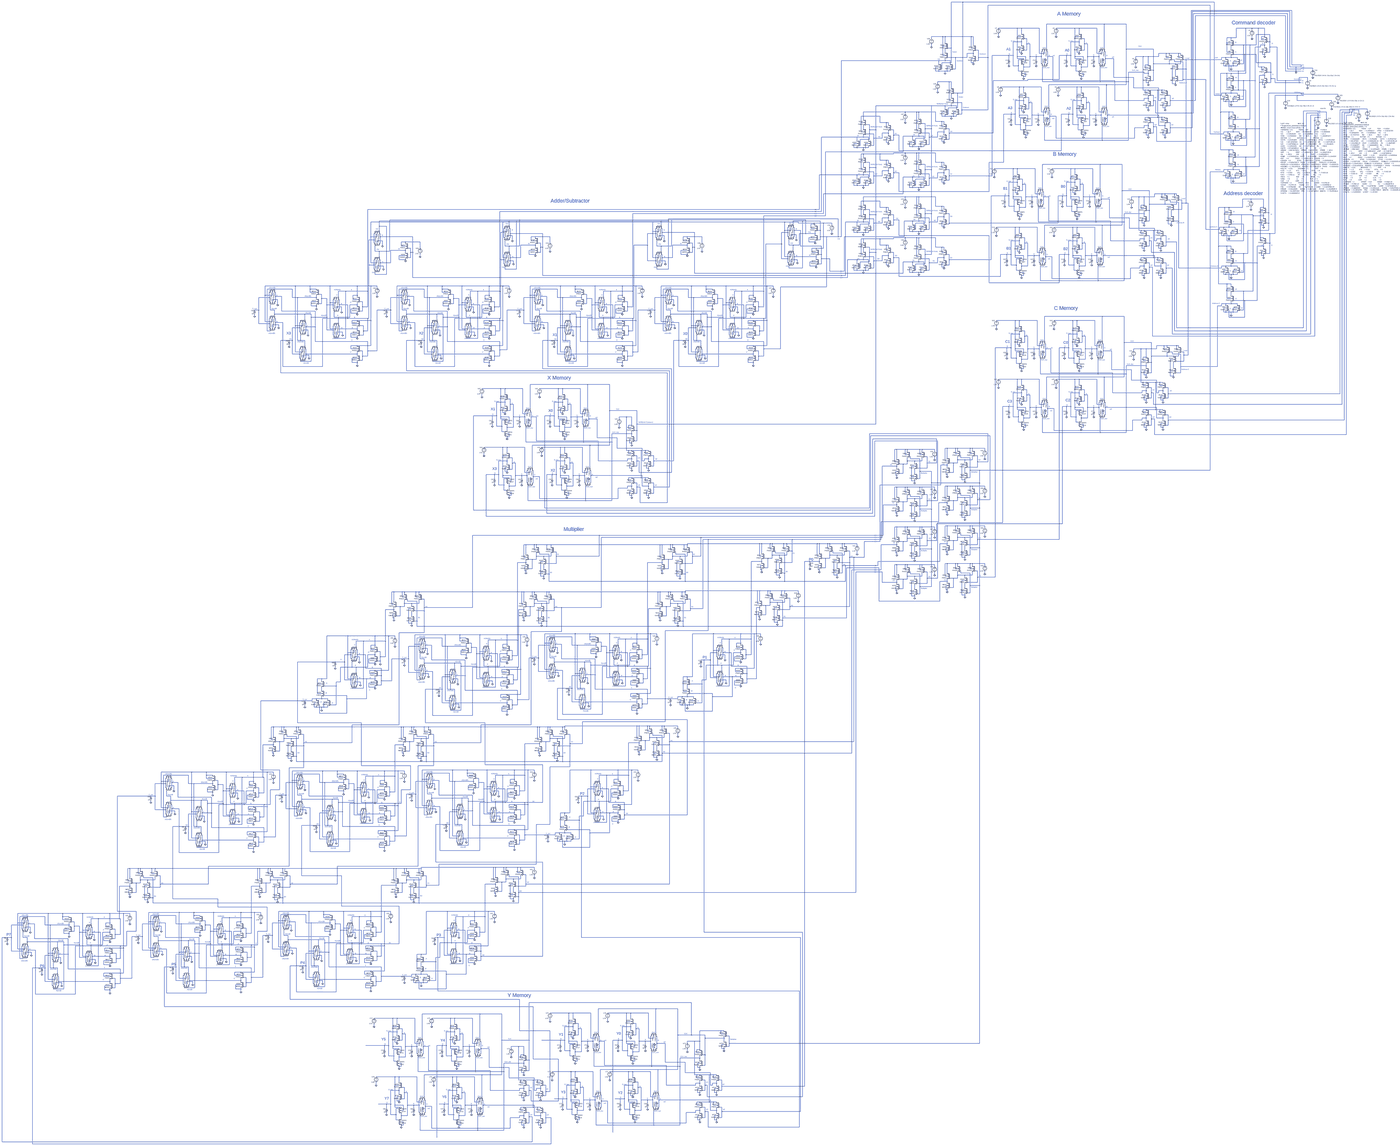
[diagram p0: schematic Ex5_Ex_Multiplier_Working.asc, whole sheet]
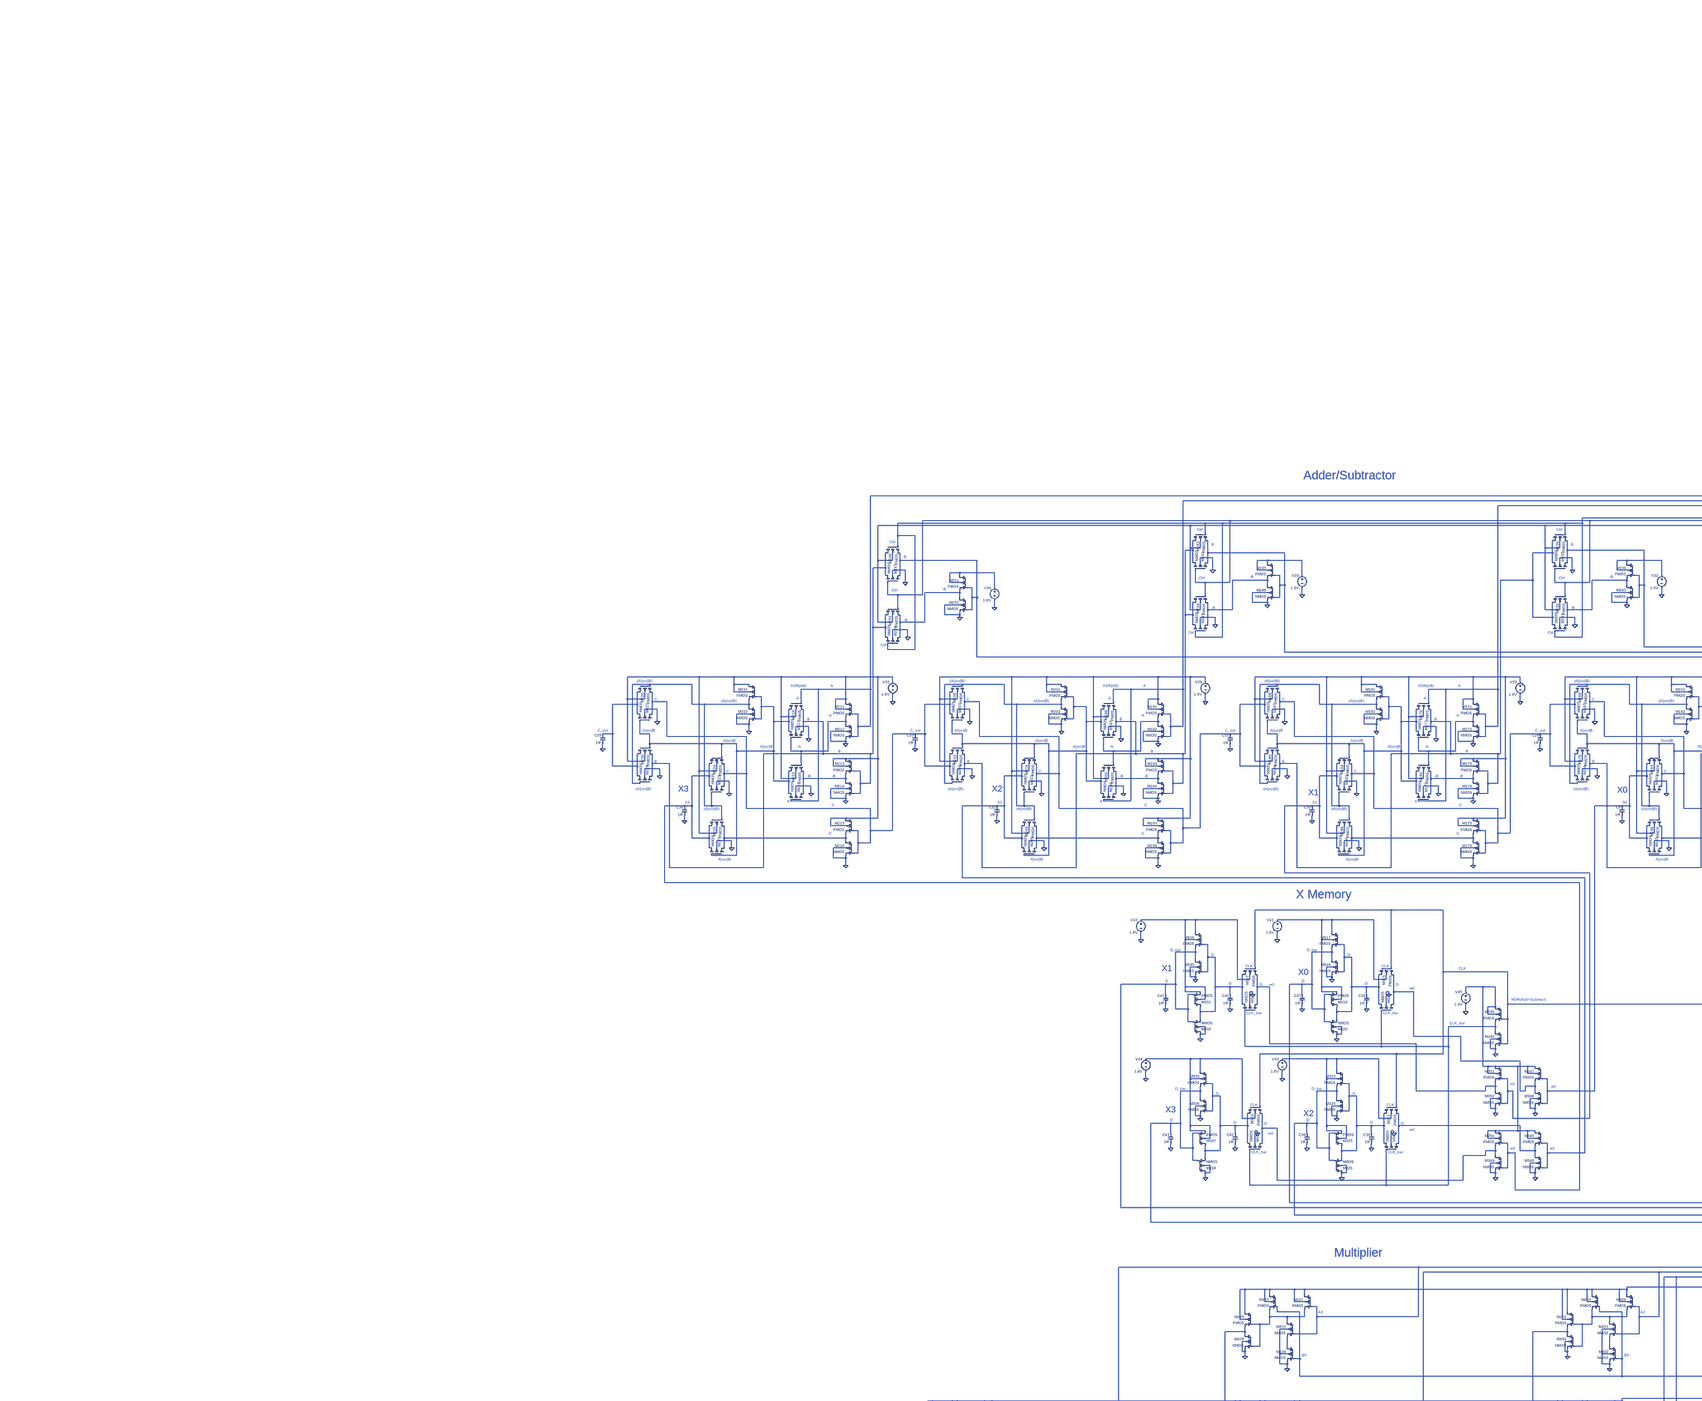
[diagram p1: schematic Ex5_Ex_Multiplier_Working.asc, part, row 1 of 2, column 1 of 2]
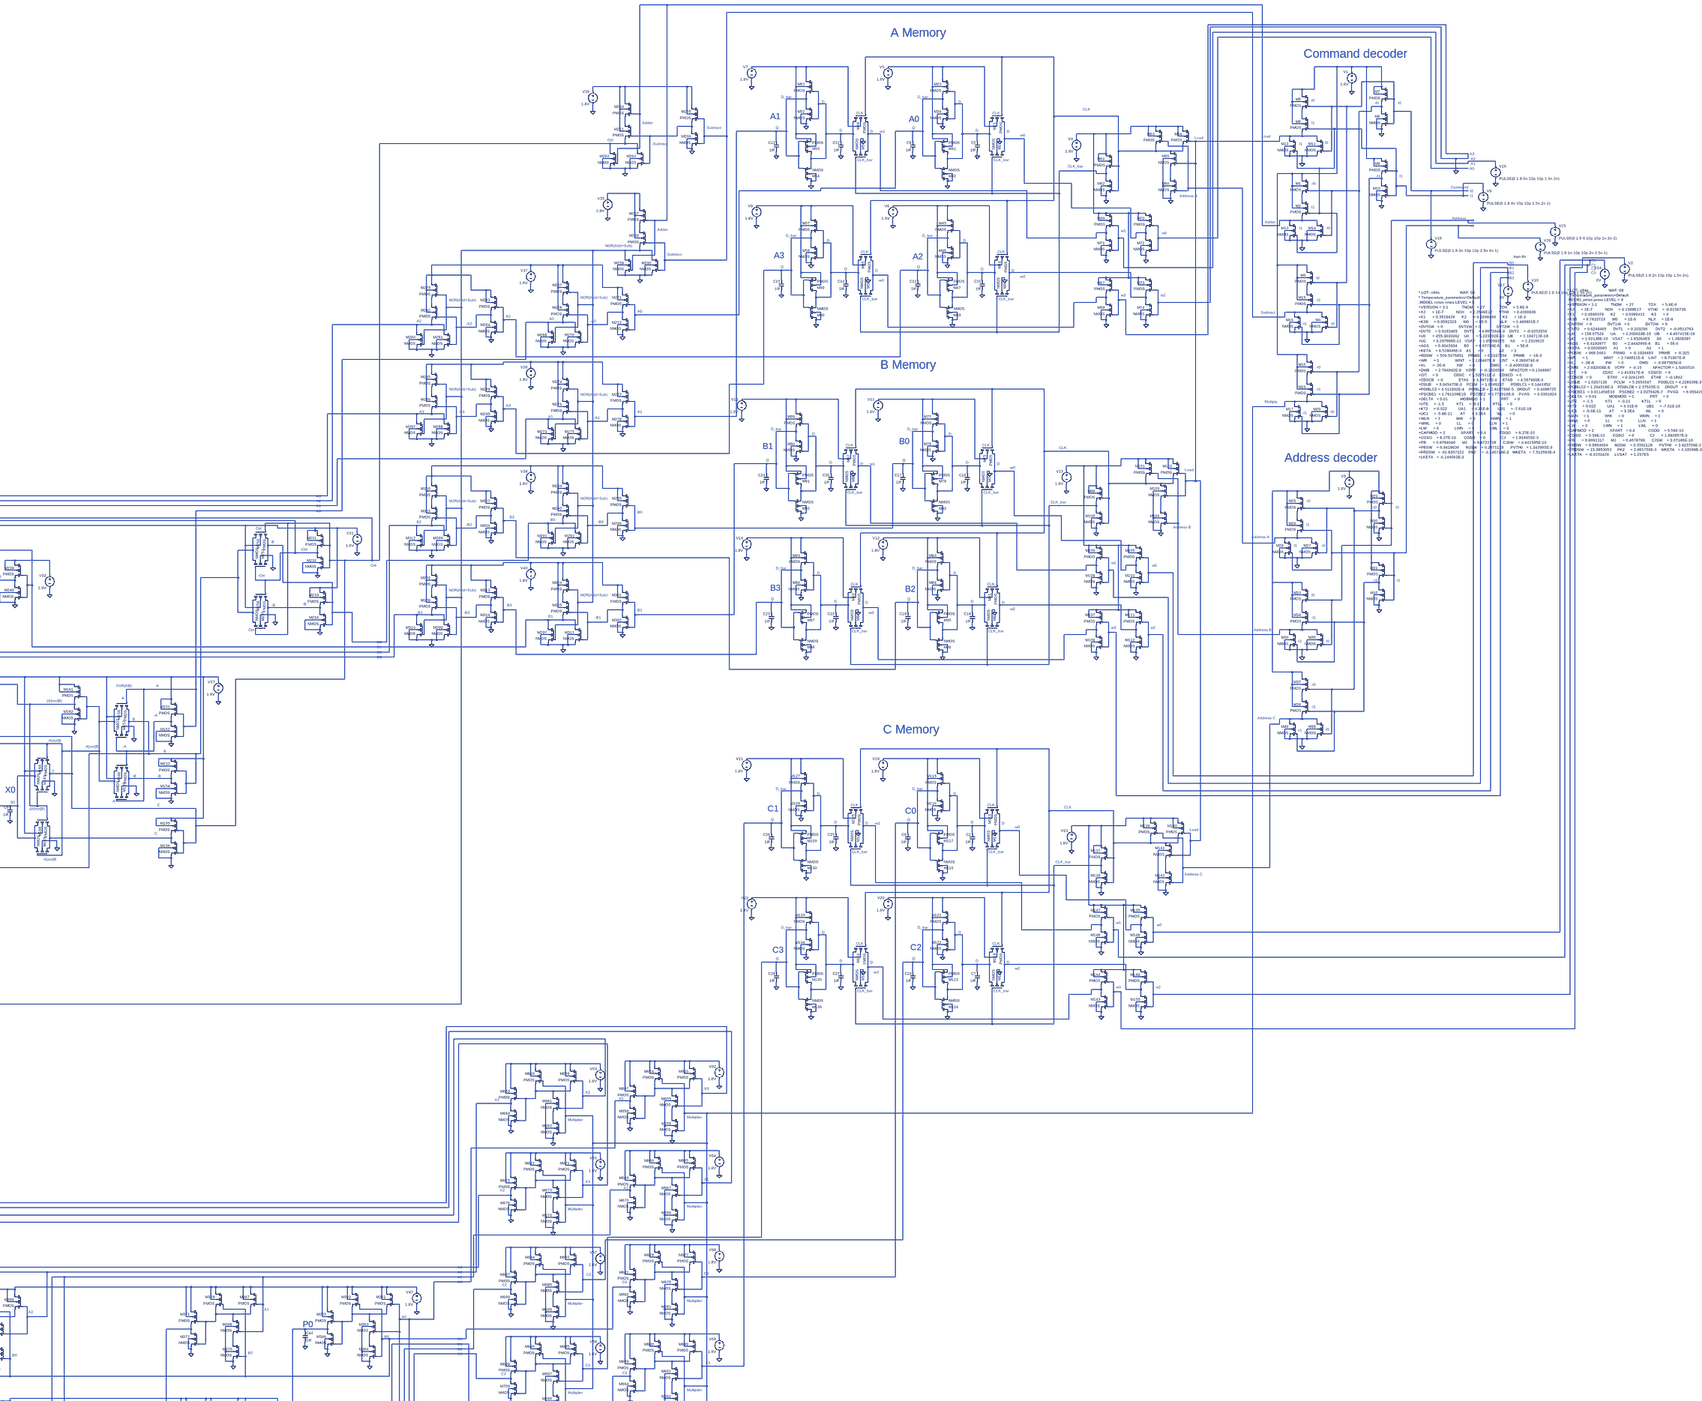
[diagram p2: schematic Ex5_Ex_Multiplier_Working.asc, part, row 1 of 2, column 2 of 2]
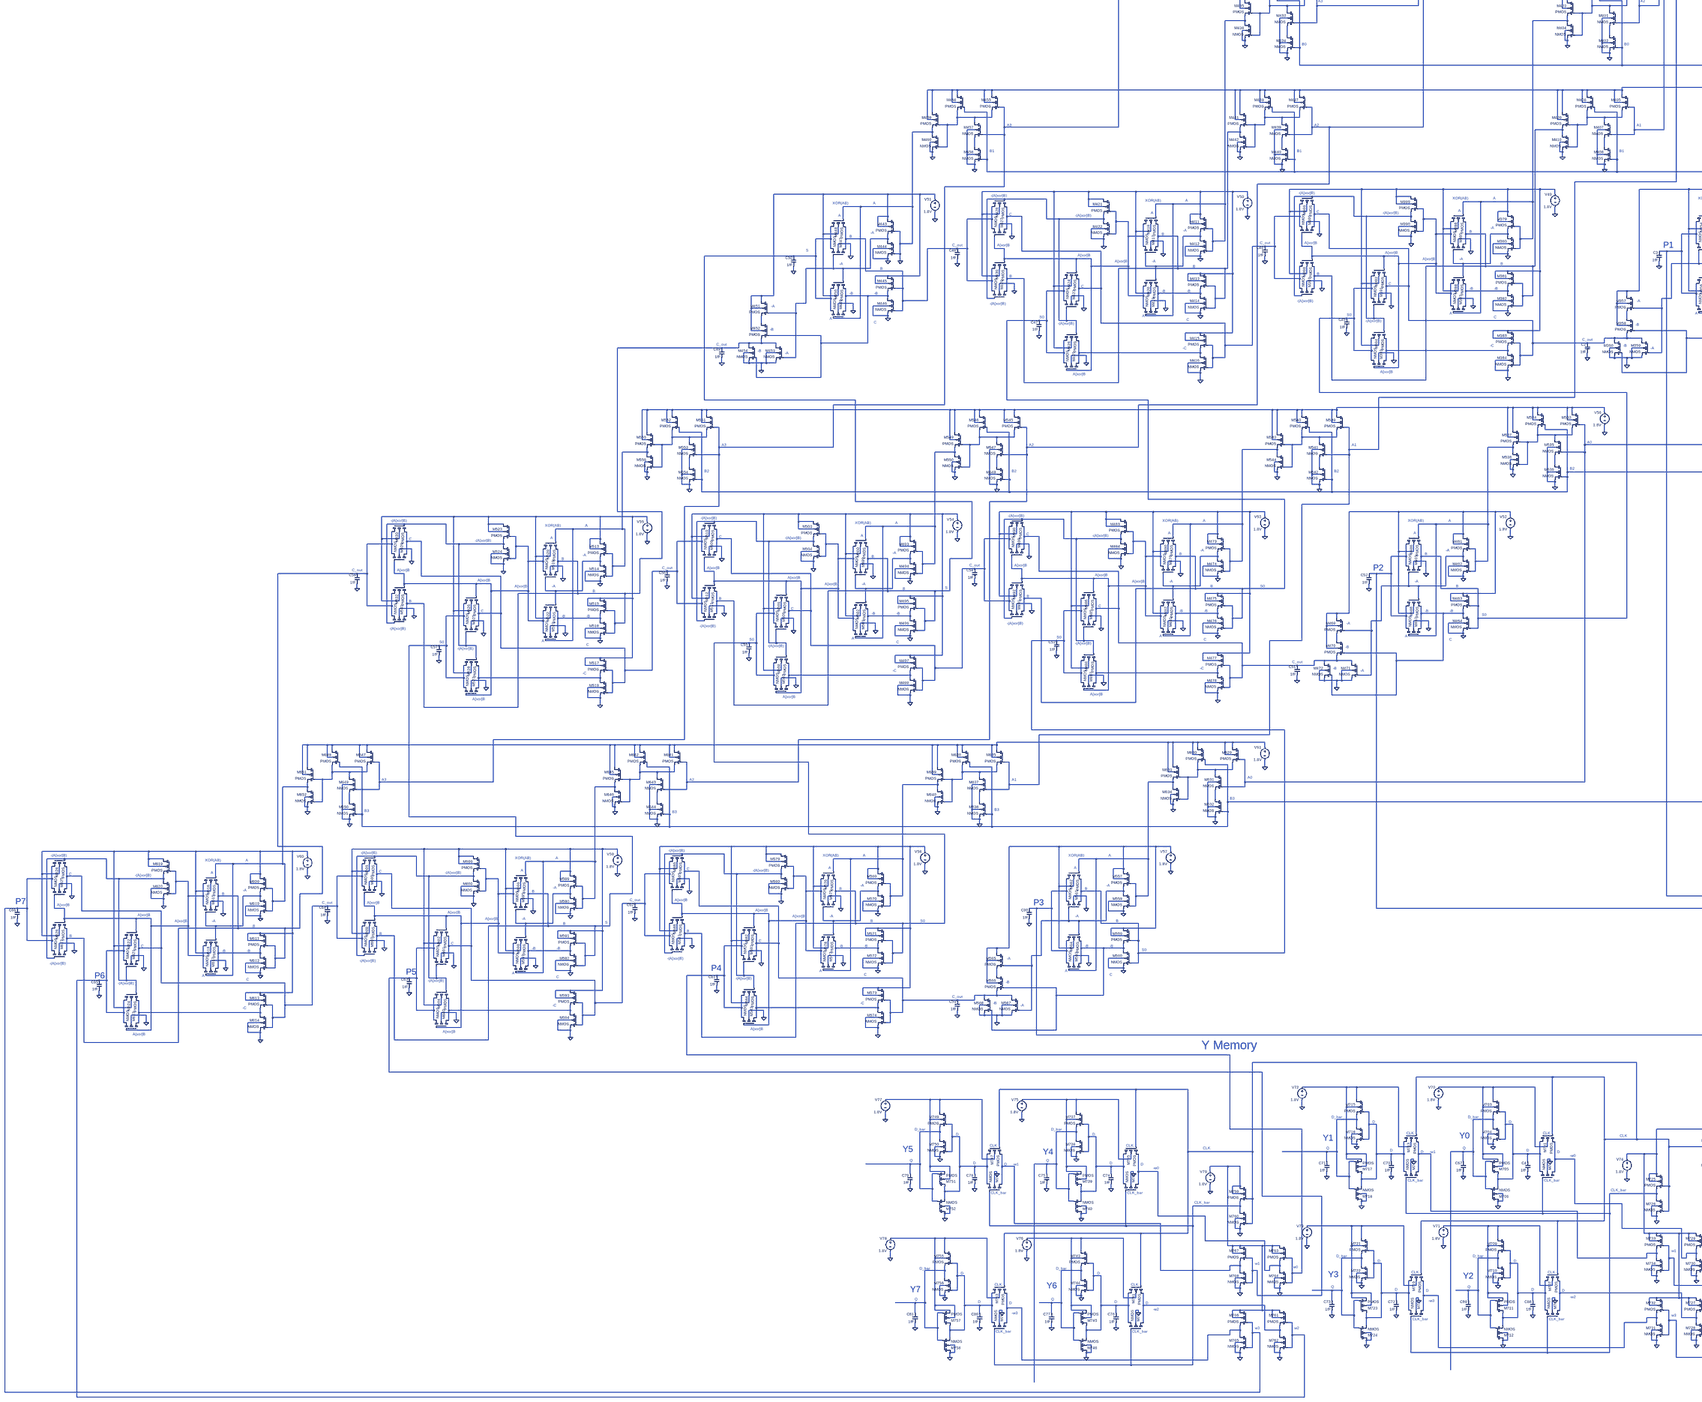
[diagram p3: schematic Ex5_Ex_Multiplier_Working.asc, part, row 2 of 2, column 1 of 2]
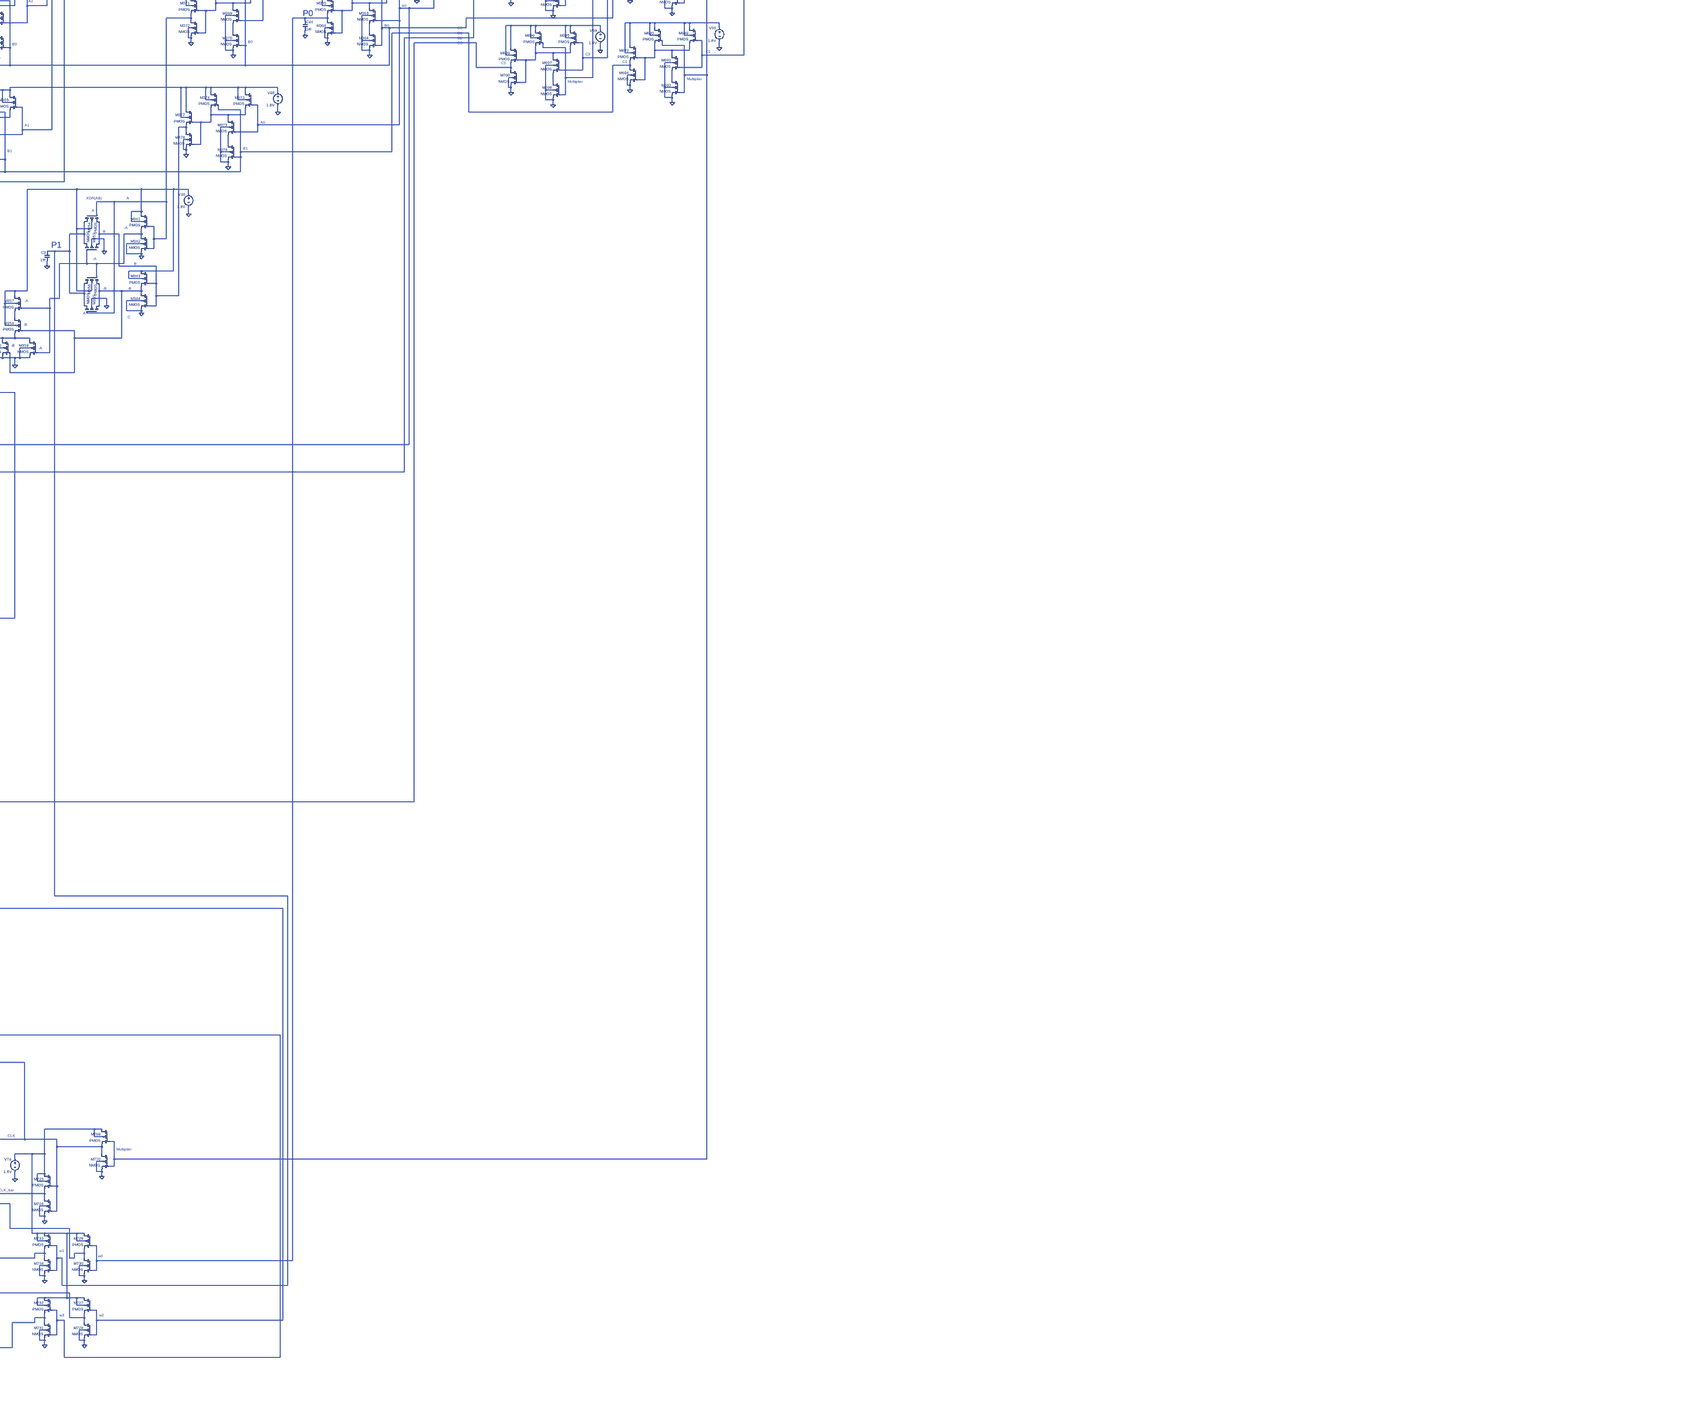
[diagram p4: schematic Ex5_Ex_Multiplier_Working.asc, part, row 2 of 2, column 2 of 2]
* Ex5_Ex_Multiplier_Working.asc
V1 N007 0 1.8V
M5 N007 N008 N015 N007 PMOS l=180n w=4400n
M6 N015 N019 N021 N007 PMOS l=180n w=4400n
M11 N021 N008 0 0 NMOS l=180n w=2200n
M12 N021 N019 0 0 NMOS l=180n w=2200n
M7 N007 N008 N014 N007 PMOS l=180n w=3000n
M8 N014 N008 0 0 NMOS l=180n w=1500n
V3 N074 0 1.8V
M25 N074 N080 N084 N074 PMOS l=180n w=3520n
M26 N084 N033 N023 N074 PMOS l=180n w=3520n
M27 N023 N080 0 0 NMOS l=180n w=1760n
M28 N023 N033 0 0 NMOS l=180n w=1760n
M29 N074 N032 N080 N074 PMOS l=180n w=880n
M30 N080 N032 0 0 NMOS l=180n w=440n
M31 N074 N033 N106 N074 PMOS l=180n w=880n
M32 N106 N033 0 0 NMOS l=180n w=440n
M33 N074 N032 N115 N074 PMOS l=180n w=3520n
M34 N115 N106 N075 N074 PMOS l=180n w=3520n
M35 N075 N032 0 0 NMOS l=180n w=1760n
M36 N075 N106 0 0 NMOS l=180n w=1760n
M37 N074 N080 N128 N074 PMOS l=180n w=3520n
M38 N128 N106 N133 N074 PMOS l=180n w=3520n
M39 N133 N080 0 0 NMOS l=180n w=1760n
M40 N133 N106 0 0 NMOS l=180n w=1760n
M21 N011 N004 N022 N006 PMOS l=180n w=6000n
M22 N022 N025 N011 0 NMOS l=180n w=6000n
M23 N006 N011 N013 N006 PMOS l=180n w=3520n
M24 N013 N011 0 0 NMOS l=180n w=1760n
M41 N011 N013 N006 N006 PMOS l=180n w=880n
M42 0 N013 N011 0 NMOS l=180n w=440n
V5 N006 0 1.8V
C5 N011 0 1fF
C9 N013 0 1fF
M43 N036 N004 N045 N031 PMOS l=180n w=6000n
M44 N045 N025 N036 0 NMOS l=180n w=6000n
M45 N031 N036 N038 N031 PMOS l=180n w=3520n
M46 N038 N036 0 0 NMOS l=180n w=1760n
M47 N036 N038 N031 N031 PMOS l=180n w=880n
M48 0 N038 N036 0 NMOS l=180n w=440n
V6 N031 0 1.8V
C10 N036 0 1fF
C11 N038 0 1fF
M49 N010 N004 N020 N005 PMOS l=180n w=6000n
M50 N020 N025 N010 0 NMOS l=180n w=6000n
M51 N005 N010 N012 N005 PMOS l=180n w=3520n
M52 N012 N010 0 0 NMOS l=180n w=1760n
M53 N010 N012 N005 N005 PMOS l=180n w=880n
M54 0 N012 N010 0 NMOS l=180n w=440n
V7 N005 0 1.8V
C12 N010 0 1fF
C13 N012 0 1fF
M55 N035 N004 N046 N030 PMOS l=180n w=6000n
M56 N046 N025 N035 0 NMOS l=180n w=6000n
M57 N030 N035 N037 N030 PMOS l=180n w=3520n
M58 N037 N035 0 0 NMOS l=180n w=1760n
M59 N035 N037 N030 N030 PMOS l=180n w=880n
M60 0 N037 N035 0 NMOS l=180n w=440n
V8 N030 0 1.8V
C14 N035 0 1fF
C15 N037 0 1fF
V4 N018 0 1.8V
M61 N018 N004 N025 N018 PMOS l=180n w=8800n
M62 N025 N004 0 0 NMOS l=180n w=4400n
M63 N018 N023 N004 N018 PMOS l=180n w=6000n
M64 N018 N021 N004 N018 PMOS l=180n w=6000n
M65 N004 N021 N026 0 NMOS l=180n w=6000n
M66 N026 N023 0 0 NMOS l=180n w=6000n
M75 N067 N056 N073 N060 PMOS l=180n w=6000n
M76 N073 N078 N067 0 NMOS l=180n w=6000n
M77 N060 N067 N069 N060 PMOS l=180n w=3520n
M78 N069 N067 0 0 NMOS l=180n w=1760n
M79 N067 N069 N060 N060 PMOS l=180n w=880n
M80 0 N069 N067 0 NMOS l=180n w=440n
V11 N060 0 1.8V
C16 N067 0 1fF
C17 N069 0 1fF
M81 N100 N056 N111 N090 PMOS l=180n w=6000n
M82 N111 N078 N100 0 NMOS l=180n w=6000n
M83 N090 N100 N079 N090 PMOS l=180n w=3520n
M84 N079 N100 0 0 NMOS l=180n w=1760n
M85 N100 N079 N090 N090 PMOS l=180n w=880n
M86 0 N079 N100 0 NMOS l=180n w=440n
V12 N090 0 1.8V
C18 N100 0 1fF
C19 N079 0 1fF
M87 N066 N056 N072 N059 PMOS l=180n w=6000n
M88 N072 N078 N066 0 NMOS l=180n w=6000n
M89 N059 N066 N068 N059 PMOS l=180n w=3520n
M90 N068 N066 0 0 NMOS l=180n w=1760n
M91 N066 N068 N059 N059 PMOS l=180n w=880n
M92 0 N068 N066 0 NMOS l=180n w=440n
V13 N059 0 1.8V
C20 N066 0 1fF
C21 N068 0 1fF
M93 N099 N056 N113 N089 PMOS l=180n w=6000n
M94 N113 N078 N099 0 NMOS l=180n w=6000n
M95 N089 N099 N102 N089 PMOS l=180n w=3520n
M96 N102 N099 0 0 NMOS l=180n w=1760n
M97 N099 N102 N089 N089 PMOS l=180n w=880n
M98 0 N102 N099 0 NMOS l=180n w=440n
V14 N089 0 1.8V
C22 N099 0 1fF
C23 N102 0 1fF
V15 N070 0 1.8V
M99 N070 N056 N078 N070 PMOS l=180n w=8800n
M100 N078 N056 0 0 NMOS l=180n w=4400n
M101 N070 N075 N056 N070 PMOS l=180n w=6000n
M102 N070 N021 N056 N070 PMOS l=180n w=6000n
M103 N056 N021 N081 0 NMOS l=180n w=6000n
M104 N081 N075 0 0 NMOS l=180n w=6000n
M111 N070 N044 N111 N070 PMOS l=180n w=4000n
M112 N111 N044 0 0 NMOS l=180n w=2000n
V17 N044 0 0V
V18 N008 0 PULSE(0 1.8 3n 10p 10p 2.5n 4n 1)
M113 N150 N138 N155 N140 PMOS l=180n w=6000n
M114 N155 N160 N150 0 NMOS l=180n w=6000n
M115 N140 N150 N152 N140 PMOS l=180n w=3520n
M116 N152 N150 0 0 NMOS l=180n w=1760n
M117 N150 N152 N140 N140 PMOS l=180n w=880n
M118 0 N152 N150 0 NMOS l=180n w=440n
V19 N140 0 1.8V
C1 N150 0 1fF
C6 N152 0 1fF
M119 N167 N138 N174 N163 PMOS l=180n w=6000n
M120 N174 N160 N167 0 NMOS l=180n w=6000n
M121 N163 N167 N169 N163 PMOS l=180n w=3520n
M122 N169 N167 0 0 NMOS l=180n w=1760n
M123 N167 N169 N163 N163 PMOS l=180n w=880n
M124 0 N169 N167 0 NMOS l=180n w=440n
V20 N163 0 1.8V
C7 N167 0 1fF
C24 N169 0 1fF
M125 N149 N138 N154 N139 PMOS l=180n w=6000n
M126 N154 N160 N149 0 NMOS l=180n w=6000n
M127 N139 N149 N151 N139 PMOS l=180n w=3520n
M128 N151 N149 0 0 NMOS l=180n w=1760n
M129 N149 N151 N139 N139 PMOS l=180n w=880n
M130 0 N151 N149 0 NMOS l=180n w=440n
V21 N139 0 1.8V
C25 N149 0 1fF
C26 N151 0 1fF
M131 N166 N138 N175 N162 PMOS l=180n w=6000n
M132 N175 N160 N166 0 NMOS l=180n w=6000n
M133 N162 N166 N168 N162 PMOS l=180n w=3520n
M134 N168 N166 0 0 NMOS l=180n w=1760n
M135 N166 N168 N162 N162 PMOS l=180n w=880n
M136 0 N168 N166 0 NMOS l=180n w=440n
V22 N162 0 1.8V
C27 N166 0 1fF
C28 N168 0 1fF
V23 N153 0 1.8V
M137 N153 N138 N160 N153 PMOS l=180n w=8800n
M138 N160 N138 0 0 NMOS l=180n w=4400n
M139 N153 N133 N138 N153 PMOS l=180n w=6000n
M140 N153 N021 N138 N153 PMOS l=180n w=6000n
M141 N138 N021 N161 0 NMOS l=180n w=6000n
M142 N161 N133 0 0 NMOS l=180n w=6000n
M149 N153 N040 N174 N153 PMOS l=180n w=4000n
M150 N174 N040 0 0 NMOS l=180n w=2000n
V24 N041 0 0V
M145 N153 N041 N155 N153 PMOS l=180n w=4000n
M146 N155 N041 0 0 NMOS l=180n w=2000n
M143 N175 N041 0 0 NMOS l=180n w=2000n
M144 N153 N041 N175 N153 PMOS l=180n w=4000n
M147 N153 N041 N154 N153 PMOS l=180n w=4000n
M148 N154 N041 0 0 NMOS l=180n w=2000n
M105 N070 N042 N073 N070 PMOS l=180n w=4000n
M106 N070 N044 N072 N070 PMOS l=180n w=4000n
M107 N070 N044 N113 N070 PMOS l=180n w=4000n
M108 N113 N044 0 0 NMOS l=180n w=2000n
M109 N072 N044 0 0 NMOS l=180n w=2000n
M110 N073 N042 0 0 NMOS l=180n w=2000n
M73 N018 0 N045 N018 PMOS l=180n w=4000n
M74 N045 0 0 0 NMOS l=180n w=2000n
M67 N018 0 N046 N018 PMOS l=180n w=4000n
M68 N046 0 0 0 NMOS l=180n w=2000n
M69 N018 N003 N020 N018 PMOS l=180n w=4000n
M70 N018 0 N022 N018 PMOS l=180n w=4000n
M71 N020 N003 0 0 NMOS l=180n w=2000n
M72 N022 0 0 0 NMOS l=180n w=2000n
V27 N119 0 1.8V
M151 N119 N052 N137 N119 PMOS l=180n w=880n
M152 N137 N052 0 0 NMOS l=180n w=440n
M153 N119 N093 N148 N119 PMOS l=180n w=880n
M154 N148 N093 0 0 NMOS l=180n w=440n
M155 N119 N024 N159 N119 PMOS l=180n w=880n
M156 N159 N024 0 0 NMOS l=180n w=440n
M157 N093 N137 N127 0 NMOS l=180n w=440n
M158 N127 N052 N093 N119 PMOS l=180n w=440n
M159 N148 N052 N127 0 NMOS l=180n w=440n
M160 N127 N137 N148 N119 PMOS l=180n w=440n
M161 N119 N127 N123 N119 PMOS l=180n w=880n
M162 N123 N127 0 0 NMOS l=180n w=440n
M163 N024 N123 N144 0 NMOS l=180n w=440n
M164 N144 N127 N024 N119 PMOS l=180n w=440n
M165 N159 N127 N144 0 NMOS l=180n w=440n
M166 N144 N123 N159 N119 PMOS l=180n w=440n
C8 N144 0 1fF
M167 N024 N127 N131 0 NMOS l=180n w=440n
M168 N131 N123 N024 N119 PMOS l=180n w=440n
M169 N093 N123 N131 0 NMOS l=180n w=440n
M170 N131 N127 N093 N119 PMOS l=180n w=440n
C29 N131 0 1fF
V28 N118 0 1.8V
M171 N118 N065 N136 N118 PMOS l=180n w=880n
M172 N136 N065 0 0 NMOS l=180n w=440n
M173 N118 N094 N147 N118 PMOS l=180n w=880n
M174 N147 N094 0 0 NMOS l=180n w=440n
M175 N118 N131 N158 N118 PMOS l=180n w=880n
M176 N158 N131 0 0 NMOS l=180n w=440n
M177 N094 N136 N126 0 NMOS l=180n w=440n
M178 N126 N065 N094 N118 PMOS l=180n w=440n
M179 N147 N065 N126 0 NMOS l=180n w=440n
M180 N126 N136 N147 N118 PMOS l=180n w=440n
M181 N118 N126 N122 N118 PMOS l=180n w=880n
M182 N122 N126 0 0 NMOS l=180n w=440n
M183 N131 N122 N143 0 NMOS l=180n w=440n
M184 N143 N126 N131 N118 PMOS l=180n w=440n
M185 N158 N126 N143 0 NMOS l=180n w=440n
M186 N143 N122 N158 N118 PMOS l=180n w=440n
C30 N143 0 1fF
M187 N131 N126 N130 0 NMOS l=180n w=440n
M188 N130 N122 N131 N118 PMOS l=180n w=440n
M189 N094 N122 N130 0 NMOS l=180n w=440n
M190 N130 N126 N094 N118 PMOS l=180n w=440n
C31 N130 0 1fF
V29 N117 0 1.8V
M191 N117 N053 N135 N117 PMOS l=180n w=880n
M192 N135 N053 0 0 NMOS l=180n w=440n
M193 N117 N091 N146 N117 PMOS l=180n w=880n
M194 N146 N091 0 0 NMOS l=180n w=440n
M195 N117 N130 N157 N117 PMOS l=180n w=880n
M196 N157 N130 0 0 NMOS l=180n w=440n
M197 N091 N135 N125 0 NMOS l=180n w=440n
M198 N125 N053 N091 N117 PMOS l=180n w=440n
M199 N146 N053 N125 0 NMOS l=180n w=440n
M200 N125 N135 N146 N117 PMOS l=180n w=440n
M201 N117 N125 N121 N117 PMOS l=180n w=880n
M202 N121 N125 0 0 NMOS l=180n w=440n
M203 N130 N121 N142 0 NMOS l=180n w=440n
M204 N142 N125 N130 N117 PMOS l=180n w=440n
M205 N157 N125 N142 0 NMOS l=180n w=440n
M206 N142 N121 N157 N117 PMOS l=180n w=440n
C32 N142 0 1fF
M207 N130 N125 N129 0 NMOS l=180n w=440n
M208 N129 N121 N130 N117 PMOS l=180n w=440n
M209 N091 N121 N129 0 NMOS l=180n w=440n
M210 N129 N125 N091 N117 PMOS l=180n w=440n
C33 N129 0 1fF
V30 N116 0 1.8V
M211 N116 N064 N134 N116 PMOS l=180n w=880n
M212 N134 N064 0 0 NMOS l=180n w=440n
M213 N116 N101 N145 N116 PMOS l=180n w=880n
M214 N145 N101 0 0 NMOS l=180n w=440n
M215 N116 N129 N156 N116 PMOS l=180n w=880n
M216 N156 N129 0 0 NMOS l=180n w=440n
M217 N101 N134 N124 0 NMOS l=180n w=440n
M218 N124 N064 N101 N116 PMOS l=180n w=440n
M219 N145 N064 N124 0 NMOS l=180n w=440n
M220 N124 N134 N145 N116 PMOS l=180n w=440n
M221 N116 N124 N120 N116 PMOS l=180n w=880n
M222 N120 N124 0 0 NMOS l=180n w=440n
M223 N129 N120 N141 0 NMOS l=180n w=440n
M224 N141 N124 N129 N116 PMOS l=180n w=440n
M225 N156 N124 N141 0 NMOS l=180n w=440n
M226 N141 N120 N156 N116 PMOS l=180n w=440n
C34 N141 0 1fF
M227 N129 N124 N132 0 NMOS l=180n w=440n
M228 N132 N120 N129 N116 PMOS l=180n w=440n
M229 N101 N120 N132 0 NMOS l=180n w=440n
M230 N132 N124 N101 N116 PMOS l=180n w=440n
C35 N132 0 1fF
M231 N087 N024 N085 N087 PMOS l=180n w=880n
M232 N085 N024 0 0 NMOS l=180n w=440n
M233 N087 N086 N112 N087 PMOS l=180n w=880n
M234 N112 N086 0 0 NMOS l=180n w=440n
V31 N087 0 1.8V
M235 N092 N085 N094 0 NMOS l=180n w=440n
M236 N094 N024 N092 N087 PMOS l=180n w=440n
M237 N105 N024 N094 0 NMOS l=180n w=440n
M238 N094 N085 N105 N087 PMOS l=180n w=440n
M239 N097 N092 N105 N097 PMOS l=180n w=880n
M240 N105 N092 0 0 NMOS l=180n w=440n
V32 N097 0 1.8V
M241 N088 N085 N091 0 NMOS l=180n w=440n
M242 N091 N024 N088 N087 PMOS l=180n w=440n
M243 N104 N024 N091 0 NMOS l=180n w=440n
M244 N091 N085 N104 N087 PMOS l=180n w=440n
M245 N096 N088 N104 N096 PMOS l=180n w=880n
M246 N104 N088 0 0 NMOS l=180n w=440n
V33 N096 0 1.8V
M247 N095 N085 N101 0 NMOS l=180n w=440n
M248 N101 N024 N095 N087 PMOS l=180n w=440n
M249 N107 N024 N101 0 NMOS l=180n w=440n
M250 N101 N085 N107 N087 PMOS l=180n w=440n
M251 N103 N095 N107 N103 PMOS l=180n w=880n
M252 N107 N095 0 0 NMOS l=180n w=440n
V34 N103 0 1.8V
M253 N086 N085 N093 0 NMOS l=180n w=440n
M254 N093 N024 N086 N087 PMOS l=180n w=440n
M255 N112 N024 N093 0 NMOS l=180n w=440n
M256 N093 N085 N112 N087 PMOS l=180n w=440n
V35 N028 0 1.8V
M264 N009 N001 N016 N009 PMOS l=180n w=6000n
V36 N009 0 1.8V
M265 N009 N002 N017 N009 PMOS l=180n w=3000n
M266 N017 N002 0 0 NMOS l=180n w=1500n
V37 N043 0 1.8V
M271 N043 N013 N050 N043 PMOS l=180n w=880n
M272 N050 N013 0 0 NMOS l=180n w=440n
V38 N054 0 1.8V
M277 N054 N012 N063 N054 PMOS l=180n w=880n
M278 N063 N012 0 0 NMOS l=180n w=440n
M283 N043 N038 N051 N043 PMOS l=180n w=880n
M284 N051 N038 0 0 NMOS l=180n w=440n
M289 N054 N037 N062 N054 PMOS l=180n w=880n
M290 N062 N037 0 0 NMOS l=180n w=440n
M291 N086 N039 0 0 NMOS l=180n w=750n
M294 N071 N039 N076 N071 PMOS l=180n w=3000n
V39 N071 0 1.8V
M295 N071 N069 N082 N071 PMOS l=180n w=880n
M296 N082 N069 0 0 NMOS l=180n w=440n
V40 N098 0 1.8V
M301 N098 N068 N114 N098 PMOS l=180n w=880n
M302 N114 N068 0 0 NMOS l=180n w=440n
M307 N071 N079 N083 N071 PMOS l=180n w=880n
M308 N083 N079 0 0 NMOS l=180n w=440n
M313 N098 N102 N110 N098 PMOS l=180n w=880n
M314 N110 N102 0 0 NMOS l=180n w=440n
M315 N171 N039 N178 N165 PMOS l=180n w=6000n
M316 N178 N179 N171 0 NMOS l=180n w=6000n
M317 N165 N171 N173 N165 PMOS l=180n w=3520n
M318 N173 N171 0 0 NMOS l=180n w=1760n
M319 N171 N173 N165 N165 PMOS l=180n w=880n
M320 0 N173 N171 0 NMOS l=180n w=440n
V41 N165 0 1.8V
C36 N171 0 1fF
C37 N173 0 1fF
M321 N187 N039 N194 N183 PMOS l=180n w=6000n
M322 N194 N179 N187 0 NMOS l=180n w=6000n
M323 N183 N187 N180 N183 PMOS l=180n w=3520n
M324 N180 N187 0 0 NMOS l=180n w=1760n
M325 N187 N180 N183 N183 PMOS l=180n w=880n
M326 0 N180 N187 0 NMOS l=180n w=440n
V42 N183 0 1.8V
C38 N187 0 1fF
C39 N180 0 1fF
M327 N170 N039 N176 N164 PMOS l=180n w=6000n
M328 N176 N179 N170 0 NMOS l=180n w=6000n
M329 N164 N170 N172 N164 PMOS l=180n w=3520n
M330 N172 N170 0 0 NMOS l=180n w=1760n
M331 N170 N172 N164 N164 PMOS l=180n w=880n
M332 0 N172 N170 0 NMOS l=180n w=440n
V43 N164 0 1.8V
C40 N170 0 1fF
C41 N172 0 1fF
M333 N186 N039 N195 N182 PMOS l=180n w=6000n
M334 N195 N179 N186 0 NMOS l=180n w=6000n
M335 N182 N186 N181 N182 PMOS l=180n w=3520n
M336 N181 N186 0 0 NMOS l=180n w=1760n
M337 N186 N181 N182 N182 PMOS l=180n w=880n
M338 0 N181 N186 0 NMOS l=180n w=440n
V44 N182 0 1.8V
C42 N186 0 1fF
C43 N181 0 1fF
V45 N177 0 1.8V
M339 N177 N039 N179 N177 PMOS l=180n w=8800n
M340 N179 N039 0 0 NMOS l=180n w=4400n
M345 N177 N142 N194 N177 PMOS l=180n w=4000n
M346 N194 N142 0 0 NMOS l=180n w=2000n
M347 N177 N144 N178 N177 PMOS l=180n w=4000n
M348 N178 N144 0 0 NMOS l=180n w=2000n
M349 N195 N141 0 0 NMOS l=180n w=2000n
M350 N177 N141 N195 N177 PMOS l=180n w=4000n
M351 N177 N143 N176 N177 PMOS l=180n w=4000n
M352 N176 N143 0 0 NMOS l=180n w=2000n
M1 N007 N014 N029 N007 PMOS l=180n w=4400n
M2 N029 N019 N001 N007 PMOS l=180n w=4400n
M13 N001 N019 0 0 NMOS l=180n w=2200n
M14 N001 N014 0 0 NMOS l=180n w=2200n
M9 N007 N019 N027 N007 PMOS l=180n w=3000n
M10 N027 N019 0 0 NMOS l=180n w=1500n
M261 N016 N017 N024 N009 PMOS l=180n w=6000n
M262 N024 N017 0 0 NMOS l=180n w=1500n
M263 N024 N001 0 0 NMOS l=180n w=1500n
M257 N028 N001 N034 N028 PMOS l=180n w=6000n
M258 N034 N002 N039 N028 PMOS l=180n w=6000n
M259 N039 N001 0 0 NMOS l=180n w=2500n
V2 N040 0 PULSE(0 1.8 2n 10p 10p 1,5n 2n)
V10 N042 0 PULSE(0 1.8 1n 10p 10p 1.5n 2n)
V16 N003 0 PULSE(0 1.8 0n 10p 10p 1.5n 2n)
V25 N032 0 PULSE(0 1.8 0 10p 10p 1n 2n 2)
V26 N033 0 PULSE(0 1.8 1n 10p 10p 2n 2.5n 1)
M260 N039 N002 0 0 NMOS l=180n w=2500n
M292 N076 N082 N086 N071 PMOS l=180n w=3000n
M293 N086 N082 0 0 NMOS l=180n w=750n
M273 N065 N039 0 0 NMOS l=180n w=750n
M274 N054 N039 N058 N054 PMOS l=180n w=3000n
M275 N065 N063 0 0 NMOS l=180n w=750n
M276 N058 N063 N065 N054 PMOS l=180n w=3000n
M267 N043 N039 N048 N043 PMOS l=180n w=3000n
M268 N048 N050 N052 N043 PMOS l=180n w=3000n
M269 N052 N039 0 0 NMOS l=180n w=750n
M270 N052 N050 0 0 NMOS l=180n w=750n
M279 N043 N039 N049 N043 PMOS l=180n w=3000n
M280 N053 N039 0 0 NMOS l=180n w=750n
M281 N053 N051 0 0 NMOS l=180n w=750n
M282 N049 N051 N053 N043 PMOS l=180n w=3000n
M285 N054 N039 N057 N054 PMOS l=180n w=3000n
M286 N057 N062 N064 N054 PMOS l=180n w=3000n
M287 N064 N039 0 0 NMOS l=180n w=750n
M288 N064 N062 0 0 NMOS l=180n w=750n
M297 N092 N039 0 0 NMOS l=180n w=750n
M298 N095 N110 0 0 NMOS l=180n w=750n
M299 N088 N083 0 0 NMOS l=180n w=750n
M300 N071 N039 N077 N071 PMOS l=180n w=3000n
M303 N077 N083 N088 N071 PMOS l=180n w=3000n
M304 N098 N039 N109 N098 PMOS l=180n w=3000n
M305 N109 N114 N092 N098 PMOS l=180n w=3000n
M306 N098 N039 N108 N098 PMOS l=180n w=3000n
M309 N108 N110 N095 N098 PMOS l=180n w=3000n
M310 N095 N039 0 0 NMOS l=180n w=750n
M311 N092 N114 0 0 NMOS l=180n w=750n
M312 N088 N039 0 0 NMOS l=180n w=750n
V9 N019 0 PULSE(0 1.8 4n 10p 10p 1.5n 2n 1)
V46 N246 0 1.8V
M341 N246 N217 N258 N246 PMOS l=180n w=880n
M342 N258 N217 0 0 NMOS l=180n w=440n
M343 N246 N238 N265 N246 PMOS l=180n w=880n
M344 N265 N238 0 0 NMOS l=180n w=440n
M353 N238 N258 N257 0 NMOS l=180n w=440n
M354 N257 N217 N238 N246 PMOS l=180n w=440n
M355 N265 N217 N257 0 NMOS l=180n w=440n
M356 N257 N258 N265 N246 PMOS l=180n w=440n
C2 N253 0 1fF
C3 N257 0 1fF
M357 N246 N258 N268 N246 PMOS l=180n w=1760n
M358 N268 N265 N253 N246 PMOS l=180n w=1760n
M359 N253 N258 0 0 NMOS l=180n w=440n
M360 N253 N265 0 0 NMOS l=180n w=440n
M361 N208 N190 N214 N208 PMOS l=180n w=880n
M362 N208 N209 N214 N208 PMOS l=180n w=880n
M363 N214 N190 N224 0 NMOS l=180n w=880n
M364 N224 N209 0 0 NMOS l=180n w=880n
M365 N208 N214 N218 N208 PMOS l=180n w=880n
M366 N218 N214 0 0 NMOS l=180n w=440n
V47 N208 0 1.8V
C44 N218 0 1fF
M367 N208 N200 N213 N208 PMOS l=180n w=880n
M368 N208 N209 N213 N208 PMOS l=180n w=880n
M369 N213 N200 N223 0 NMOS l=180n w=880n
M370 N223 N209 0 0 NMOS l=180n w=880n
M371 N208 N213 N217 N208 PMOS l=180n w=880n
M372 N217 N213 0 0 NMOS l=180n w=440n
M373 N233 N190 N234 N233 PMOS l=180n w=880n
M374 N233 N225 N234 N233 PMOS l=180n w=880n
M375 N234 N190 N241 0 NMOS l=180n w=880n
M376 N241 N225 0 0 NMOS l=180n w=880n
M377 N233 N234 N238 N233 PMOS l=180n w=880n
M378 N238 N234 0 0 NMOS l=180n w=440n
V48 N233 0 1.8V
V49 N245 0 1.8V
M379 N245 N220 N256 N245 PMOS l=180n w=880n
M380 N256 N220 0 0 NMOS l=180n w=440n
M381 N245 N239 N264 N245 PMOS l=180n w=880n
M382 N264 N239 0 0 NMOS l=180n w=440n
M383 N245 N253 N271 N245 PMOS l=180n w=880n
M384 N271 N253 0 0 NMOS l=180n w=440n
M385 N239 N256 N251 0 NMOS l=180n w=440n
M386 N251 N220 N239 N245 PMOS l=180n w=440n
M387 N264 N220 N251 0 NMOS l=180n w=440n
M388 N251 N256 N264 N245 PMOS l=180n w=440n
M389 N245 N251 N249 N245 PMOS l=180n w=880n
M390 N249 N251 0 0 NMOS l=180n w=440n
M391 N253 N249 N262 0 NMOS l=180n w=440n
M392 N262 N251 N253 N245 PMOS l=180n w=440n
M393 N271 N251 N262 0 NMOS l=180n w=440n
M394 N262 N249 N271 N245 PMOS l=180n w=440n
C45 N262 0 1fF
M395 N253 N251 N254 0 NMOS l=180n w=440n
M396 N254 N249 N253 N245 PMOS l=180n w=440n
M397 N239 N249 N254 0 NMOS l=180n w=440n
M398 N254 N251 N239 N245 PMOS l=180n w=440n
C46 N254 0 1fF
M399 N208 N191 N216 N208 PMOS l=180n w=880n
M400 N208 N209 N216 N208 PMOS l=180n w=880n
M401 N216 N191 N227 0 NMOS l=180n w=880n
M402 N227 N209 0 0 NMOS l=180n w=880n
M403 N208 N216 N220 N208 PMOS l=180n w=880n
M404 N220 N216 0 0 NMOS l=180n w=440n
M405 N233 N200 N237 N233 PMOS l=180n w=880n
M406 N233 N225 N237 N233 PMOS l=180n w=880n
M407 N237 N200 N244 0 NMOS l=180n w=880n
M408 N244 N225 0 0 NMOS l=180n w=880n
M409 N233 N237 N239 N233 PMOS l=180n w=880n
M410 N239 N237 0 0 NMOS l=180n w=440n
V50 N247 0 1.8V
M411 N247 N219 N259 N247 PMOS l=180n w=880n
M412 N259 N219 0 0 NMOS l=180n w=440n
M413 N247 N240 N266 N247 PMOS l=180n w=880n
M414 N266 N240 0 0 NMOS l=180n w=440n
M415 N247 N254 N272 N247 PMOS l=180n w=880n
M416 N272 N254 0 0 NMOS l=180n w=440n
M417 N240 N259 N252 0 NMOS l=180n w=440n
M418 N252 N219 N240 N247 PMOS l=180n w=440n
M419 N266 N219 N252 0 NMOS l=180n w=440n
M420 N252 N259 N266 N247 PMOS l=180n w=440n
M421 N247 N252 N250 N247 PMOS l=180n w=880n
M422 N250 N252 0 0 NMOS l=180n w=440n
M423 N254 N250 N263 0 NMOS l=180n w=440n
M424 N263 N252 N254 N247 PMOS l=180n w=440n
M425 N272 N252 N263 0 NMOS l=180n w=440n
M426 N263 N250 N272 N247 PMOS l=180n w=440n
C47 N263 0 1fF
M427 N254 N252 N255 0 NMOS l=180n w=440n
M428 N255 N250 N254 N247 PMOS l=180n w=440n
M429 N240 N250 N255 0 NMOS l=180n w=440n
M430 N255 N252 N240 N247 PMOS l=180n w=440n
C48 N255 0 1fF
M431 N208 N201 N215 N208 PMOS l=180n w=880n
M432 N208 N209 N215 N208 PMOS l=180n w=880n
M433 N215 N201 N226 0 NMOS l=180n w=880n
M434 N226 N209 0 0 NMOS l=180n w=880n
M435 N208 N215 N219 N208 PMOS l=180n w=880n
M436 N219 N215 0 0 NMOS l=180n w=440n
M437 N233 N191 N236 N233 PMOS l=180n w=880n
M438 N233 N225 N236 N233 PMOS l=180n w=880n
M439 N236 N191 N243 0 NMOS l=180n w=880n
M440 N243 N225 0 0 NMOS l=180n w=880n
M441 N233 N236 N240 N233 PMOS l=180n w=880n
M442 N240 N236 0 0 NMOS l=180n w=440n
V51 N248 0 1.8V
M443 N248 0 N261 N248 PMOS l=180n w=880n
M444 N261 0 0 0 NMOS l=180n w=440n
M445 N248 N255 N267 N248 PMOS l=180n w=880n
M446 N267 N255 0 0 NMOS l=180n w=440n
M447 N255 N261 N260 0 NMOS l=180n w=440n
M448 N260 0 N255 N248 PMOS l=180n w=440n
M449 N267 0 N260 0 NMOS l=180n w=440n
M450 N260 N261 N267 N248 PMOS l=180n w=440n
C49 N270 0 1fF
C50 N260 0 1fF
M451 N248 N261 N269 N248 PMOS l=180n w=1760n
M452 N269 N267 N270 N248 PMOS l=180n w=1760n
M453 N270 N261 0 0 NMOS l=180n w=440n
M454 N270 N267 0 0 NMOS l=180n w=440n
M455 N233 N201 N235 N233 PMOS l=180n w=880n
M456 N233 N225 N235 N233 PMOS l=180n w=880n
M457 N235 N201 N242 0 NMOS l=180n w=880n
M458 N242 N225 0 0 NMOS l=180n w=880n
M459 N233 N235 0 N233 PMOS l=180n w=880n
M460 0 N235 0 0 NMOS l=180n w=440n
V52 N287 0 1.8V
M461 N287 N278 N302 N287 PMOS l=180n w=880n
M462 N302 N278 0 0 NMOS l=180n w=440n
M463 N287 N262 N308 N287 PMOS l=180n w=880n
M464 N308 N262 0 0 NMOS l=180n w=440n
M465 N262 N302 N301 0 NMOS l=180n w=440n
M466 N301 N278 N262 N287 PMOS l=180n w=440n
M467 N308 N278 N301 0 NMOS l=180n w=440n
M468 N301 N302 N308 N287 PMOS l=180n w=440n
C51 N296 0 1fF
C52 N301 0 1fF
M469 N287 N302 N312 N287 PMOS l=180n w=1760n
M470 N312 N308 N296 N287 PMOS l=180n w=1760n
M471 N296 N302 0 0 NMOS l=180n w=440n
M472 N296 N308 0 0 NMOS l=180n w=440n
V53 N286 0 1.8V
M473 N286 N279 N300 N286 PMOS l=180n w=880n
M474 N300 N279 0 0 NMOS l=180n w=440n
M475 N286 N263 N307 N286 PMOS l=180n w=880n
M476 N307 N263 0 0 NMOS l=180n w=440n
M477 N286 N296 N313 N286 PMOS l=180n w=880n
M478 N313 N296 0 0 NMOS l=180n w=440n
M479 N263 N300 N293 0 NMOS l=180n w=440n
M480 N293 N279 N263 N286 PMOS l=180n w=440n
M481 N307 N279 N293 0 NMOS l=180n w=440n
M482 N293 N300 N307 N286 PMOS l=180n w=440n
M483 N286 N293 N290 N286 PMOS l=180n w=880n
M484 N290 N293 0 0 NMOS l=180n w=440n
M485 N296 N290 N305 0 NMOS l=180n w=440n
M486 N305 N293 N296 N286 PMOS l=180n w=440n
M487 N313 N293 N305 0 NMOS l=180n w=440n
M488 N305 N290 N313 N286 PMOS l=180n w=440n
C53 N305 0 1fF
M489 N296 N293 N297 0 NMOS l=180n w=440n
M490 N297 N290 N296 N286 PMOS l=180n w=440n
M491 N263 N290 N297 0 NMOS l=180n w=440n
M492 N297 N293 N263 N286 PMOS l=180n w=440n
C54 N297 0 1fF
V54 N288 0 1.8V
M493 N288 N281 N303 N288 PMOS l=180n w=880n
M494 N303 N281 0 0 NMOS l=180n w=440n
M495 N288 N260 N310 N288 PMOS l=180n w=880n
M496 N310 N260 0 0 NMOS l=180n w=440n
M497 N288 N297 N314 N288 PMOS l=180n w=880n
M498 N314 N297 0 0 NMOS l=180n w=440n
M499 N260 N303 N294 0 NMOS l=180n w=440n
M500 N294 N281 N260 N288 PMOS l=180n w=440n
M501 N310 N281 N294 0 NMOS l=180n w=440n
M502 N294 N303 N310 N288 PMOS l=180n w=440n
M503 N288 N294 N291 N288 PMOS l=180n w=880n
M504 N291 N294 0 0 NMOS l=180n w=440n
M505 N297 N291 N306 0 NMOS l=180n w=440n
M506 N306 N294 N297 N288 PMOS l=180n w=440n
M507 N314 N294 N306 0 NMOS l=180n w=440n
M508 N306 N291 N314 N288 PMOS l=180n w=440n
C55 N306 0 1fF
M509 N297 N294 N298 0 NMOS l=180n w=440n
M510 N298 N291 N297 N288 PMOS l=180n w=440n
M511 N260 N291 N298 0 NMOS l=180n w=440n
M512 N298 N294 N260 N288 PMOS l=180n w=440n
C56 N298 0 1fF
V55 N289 0 1.8V
M513 N289 N280 N304 N289 PMOS l=180n w=880n
M514 N304 N280 0 0 NMOS l=180n w=440n
M515 N289 N270 N311 N289 PMOS l=180n w=880n
M516 N311 N270 0 0 NMOS l=180n w=440n
M517 N289 N298 N315 N289 PMOS l=180n w=880n
M518 N315 N298 0 0 NMOS l=180n w=440n
M519 N270 N304 N295 0 NMOS l=180n w=440n
M520 N295 N280 N270 N289 PMOS l=180n w=440n
M521 N311 N280 N295 0 NMOS l=180n w=440n
M522 N295 N304 N311 N289 PMOS l=180n w=440n
M523 N289 N295 N292 N289 PMOS l=180n w=880n
M524 N292 N295 0 0 NMOS l=180n w=440n
M525 N298 N292 N309 0 NMOS l=180n w=440n
M526 N309 N295 N298 N289 PMOS l=180n w=440n
M527 N315 N295 N309 0 NMOS l=180n w=440n
M528 N309 N292 N315 N289 PMOS l=180n w=440n
C57 N309 0 1fF
M529 N298 N295 N299 0 NMOS l=180n w=440n
M530 N299 N292 N298 N289 PMOS l=180n w=440n
M531 N270 N292 N299 0 NMOS l=180n w=440n
M532 N299 N295 N270 N289 PMOS l=180n w=440n
C58 N299 0 1fF
M533 N273 N190 N274 N273 PMOS l=180n w=880n
M534 N273 N210 N274 N273 PMOS l=180n w=880n
M535 N274 N190 N282 0 NMOS l=180n w=880n
M536 N282 N210 0 0 NMOS l=180n w=880n
M537 N273 N274 N278 N273 PMOS l=180n w=880n
M538 N278 N274 0 0 NMOS l=180n w=440n
V56 N273 0 1.8V
M539 N273 N200 N277 N273 PMOS l=180n w=880n
M540 N273 N210 N277 N273 PMOS l=180n w=880n
M541 N277 N200 N285 0 NMOS l=180n w=880n
M542 N285 N210 0 0 NMOS l=180n w=880n
M543 N273 N277 N279 N273 PMOS l=180n w=880n
M544 N279 N277 0 0 NMOS l=180n w=440n
M545 N273 N191 N276 N273 PMOS l=180n w=880n
M546 N273 N210 N276 N273 PMOS l=180n w=880n
M547 N276 N191 N284 0 NMOS l=180n w=880n
M548 N284 N210 0 0 NMOS l=180n w=880n
M549 N273 N276 N281 N273 PMOS l=180n w=880n
M550 N281 N276 0 0 NMOS l=180n w=440n
M551 N273 N201 N275 N273 PMOS l=180n w=880n
M552 N273 N210 N275 N273 PMOS l=180n w=880n
M553 N275 N201 N283 0 NMOS l=180n w=880n
M554 N283 N210 0 0 NMOS l=180n w=880n
M555 N273 N275 N280 N273 PMOS l=180n w=880n
M556 N280 N275 0 0 NMOS l=180n w=440n
V57 N330 0 1.8V
M557 N330 N321 N345 N330 PMOS l=180n w=880n
M558 N345 N321 0 0 NMOS l=180n w=440n
M559 N330 N305 N351 N330 PMOS l=180n w=880n
M560 N351 N305 0 0 NMOS l=180n w=440n
M561 N305 N345 N344 0 NMOS l=180n w=440n
M562 N344 N321 N305 N330 PMOS l=180n w=440n
M563 N351 N321 N344 0 NMOS l=180n w=440n
M564 N344 N345 N351 N330 PMOS l=180n w=440n
C59 N339 0 1fF
C60 N344 0 1fF
M565 N330 N345 N355 N330 PMOS l=180n w=1760n
M566 N355 N351 N339 N330 PMOS l=180n w=1760n
M567 N339 N345 0 0 NMOS l=180n w=440n
M568 N339 N351 0 0 NMOS l=180n w=440n
V58 N329 0 1.8V
M569 N329 N322 N343 N329 PMOS l=180n w=880n
M570 N343 N322 0 0 NMOS l=180n w=440n
M571 N329 N306 N350 N329 PMOS l=180n w=880n
M572 N350 N306 0 0 NMOS l=180n w=440n
M573 N329 N339 N356 N329 PMOS l=180n w=880n
M574 N356 N339 0 0 NMOS l=180n w=440n
M575 N306 N343 N336 0 NMOS l=180n w=440n
M576 N336 N322 N306 N329 PMOS l=180n w=440n
M577 N350 N322 N336 0 NMOS l=180n w=440n
M578 N336 N343 N350 N329 PMOS l=180n w=440n
M579 N329 N336 N333 N329 PMOS l=180n w=880n
M580 N333 N336 0 0 NMOS l=180n w=440n
M581 N339 N333 N348 0 NMOS l=180n w=440n
M582 N348 N336 N339 N329 PMOS l=180n w=440n
M583 N356 N336 N348 0 NMOS l=180n w=440n
M584 N348 N333 N356 N329 PMOS l=180n w=440n
C61 N348 0 1fF
M585 N339 N336 N340 0 NMOS l=180n w=440n
M586 N340 N333 N339 N329 PMOS l=180n w=440n
M587 N306 N333 N340 0 NMOS l=180n w=440n
M588 N340 N336 N306 N329 PMOS l=180n w=440n
C62 N340 0 1fF
V59 N331 0 1.8V
M589 N331 N324 N346 N331 PMOS l=180n w=880n
M590 N346 N324 0 0 NMOS l=180n w=440n
M591 N331 N309 N353 N331 PMOS l=180n w=880n
M592 N353 N309 0 0 NMOS l=180n w=440n
M593 N331 N340 N357 N331 PMOS l=180n w=880n
M594 N357 N340 0 0 NMOS l=180n w=440n
M595 N309 N346 N337 0 NMOS l=180n w=440n
M596 N337 N324 N309 N331 PMOS l=180n w=440n
M597 N353 N324 N337 0 NMOS l=180n w=440n
M598 N337 N346 N353 N331 PMOS l=180n w=440n
M599 N331 N337 N334 N331 PMOS l=180n w=880n
M600 N334 N337 0 0 NMOS l=180n w=440n
M601 N340 N334 N349 0 NMOS l=180n w=440n
M602 N349 N337 N340 N331 PMOS l=180n w=440n
M603 N357 N337 N349 0 NMOS l=180n w=440n
M604 N349 N334 N357 N331 PMOS l=180n w=440n
C63 N349 0 1fF
M605 N340 N337 N341 0 NMOS l=180n w=440n
M606 N341 N334 N340 N331 PMOS l=180n w=440n
M607 N309 N334 N341 0 NMOS l=180n w=440n
M608 N341 N337 N309 N331 PMOS l=180n w=440n
C64 N341 0 1fF
V60 N332 0 1.8V
M609 N332 N323 N347 N332 PMOS l=180n w=880n
M610 N347 N323 0 0 NMOS l=180n w=440n
M611 N332 N299 N354 N332 PMOS l=180n w=880n
M612 N354 N299 0 0 NMOS l=180n w=440n
M613 N332 N341 N358 N332 PMOS l=180n w=880n
M614 N358 N341 0 0 NMOS l=180n w=440n
M615 N299 N347 N338 0 NMOS l=180n w=440n
M616 N338 N323 N299 N332 PMOS l=180n w=440n
M617 N354 N323 N338 0 NMOS l=180n w=440n
M618 N338 N347 N354 N332 PMOS l=180n w=440n
M619 N332 N338 N335 N332 PMOS l=180n w=880n
M620 N335 N338 0 0 NMOS l=180n w=440n
M621 N341 N335 N352 0 NMOS l=180n w=440n
M622 N352 N338 N341 N332 PMOS l=180n w=440n
M623 N358 N338 N352 0 NMOS l=180n w=440n
M624 N352 N335 N358 N332 PMOS l=180n w=440n
C65 N352 0 1fF
M625 N341 N338 N342 0 NMOS l=180n w=440n
M626 N342 N335 N341 N332 PMOS l=180n w=440n
M627 N299 N335 N342 0 NMOS l=180n w=440n
M628 N342 N338 N299 N332 PMOS l=180n w=440n
C66 N342 0 1fF
M629 N316 N190 N317 N316 PMOS l=180n w=880n
M630 N316 N228 N317 N316 PMOS l=180n w=880n
M631 N317 N190 N325 0 NMOS l=180n w=880n
M632 N325 N228 0 0 NMOS l=180n w=880n
M633 N316 N317 N321 N316 PMOS l=180n w=880n
M634 N321 N317 0 0 NMOS l=180n w=440n
V61 N316 0 1.8V
M635 N316 N200 N320 N316 PMOS l=180n w=880n
M636 N316 N228 N320 N316 PMOS l=180n w=880n
M637 N320 N200 N328 0 NMOS l=180n w=880n
M638 N328 N228 0 0 NMOS l=180n w=880n
M639 N316 N320 N322 N316 PMOS l=180n w=880n
M640 N322 N320 0 0 NMOS l=180n w=440n
M641 N316 N191 N319 N316 PMOS l=180n w=880n
M642 N316 N228 N319 N316 PMOS l=180n w=880n
M643 N319 N191 N327 0 NMOS l=180n w=880n
M644 N327 N228 0 0 NMOS l=180n w=880n
M645 N316 N319 N324 N316 PMOS l=180n w=880n
M646 N324 N319 0 0 NMOS l=180n w=440n
M647 N316 N201 N318 N316 PMOS l=180n w=880n
M648 N316 N228 N318 N316 PMOS l=180n w=880n
M649 N318 N201 N326 0 NMOS l=180n w=880n
M650 N326 N228 0 0 NMOS l=180n w=880n
M651 N316 N318 N323 N316 PMOS l=180n w=880n
M652 N323 N318 0 0 NMOS l=180n w=440n
M653 N184 N173 N188 N184 PMOS l=180n w=880n
M654 N184 N061 N188 N184 PMOS l=180n w=880n
M655 N188 N173 N192 0 NMOS l=180n w=880n
M656 N192 N061 0 0 NMOS l=180n w=880n
M657 N184 N188 N190 N184 PMOS l=180n w=880n
M658 N190 N188 0 0 NMOS l=180n w=440n
V62 N184 0 1.8V
M659 N185 N180 N189 N185 PMOS l=180n w=880n
M660 N185 N061 N189 N185 PMOS l=180n w=880n
M661 N189 N180 N193 0 NMOS l=180n w=880n
M662 N193 N061 0 0 NMOS l=180n w=880n
M663 N185 N189 N191 N185 PMOS l=180n w=880n
M664 N191 N189 0 0 NMOS l=180n w=440n
V63 N185 0 1.8V
M665 N196 N172 N198 N196 PMOS l=180n w=880n
M666 N196 N061 N198 N196 PMOS l=180n w=880n
M667 N198 N172 N202 0 NMOS l=180n w=880n
M668 N202 N061 0 0 NMOS l=180n w=880n
M669 N196 N198 N200 N196 PMOS l=180n w=880n
M670 N200 N198 0 0 NMOS l=180n w=440n
V64 N196 0 1.8V
M671 N197 N181 N199 N197 PMOS l=180n w=880n
M672 N197 N061 N199 N197 PMOS l=180n w=880n
M673 N199 N181 N203 0 NMOS l=180n w=880n
M674 N203 N061 0 0 NMOS l=180n w=880n
M675 N197 N199 N201 N197 PMOS l=180n w=880n
M676 N201 N199 0 0 NMOS l=180n w=440n
V65 N197 0 1.8V
M677 N204 N152 N206 N204 PMOS l=180n w=880n
M678 N204 N061 N206 N204 PMOS l=180n w=880n
M679 N206 N152 N211 0 NMOS l=180n w=880n
M680 N211 N061 0 0 NMOS l=180n w=880n
M681 N204 N206 N209 N204 PMOS l=180n w=880n
M682 N209 N206 0 0 NMOS l=180n w=440n
V66 N204 0 1.8V
M683 N205 N169 N207 N205 PMOS l=180n w=880n
M684 N205 N061 N207 N205 PMOS l=180n w=880n
M685 N207 N169 N212 0 NMOS l=180n w=880n
M686 N212 N061 0 0 NMOS l=180n w=880n
M687 N205 N207 N210 N205 PMOS l=180n w=880n
M688 N210 N207 0 0 NMOS l=180n w=440n
V67 N205 0 1.8V
M689 N221 N151 N229 N221 PMOS l=180n w=880n
M690 N221 N061 N229 N221 PMOS l=180n w=880n
M691 N229 N151 N231 0 NMOS l=180n w=880n
M692 N231 N061 0 0 NMOS l=180n w=880n
M693 N221 N229 N225 N221 PMOS l=180n w=880n
M694 N225 N229 0 0 NMOS l=180n w=440n
V68 N221 0 1.8V
M695 N222 N168 N230 N222 PMOS l=180n w=880n
M696 N222 N061 N230 N222 PMOS l=180n w=880n
M697 N230 N168 N232 0 NMOS l=180n w=880n
M698 N232 N061 0 0 NMOS l=180n w=880n
M699 N222 N230 N228 N222 PMOS l=180n w=880n
M700 N228 N230 0 0 NMOS l=180n w=440n
V69 N222 0 1.8V
M3 N007 N008 N047 N007 PMOS l=180n w=4400n
M4 N002 N008 0 0 NMOS l=180n w=2200n
M15 N047 N027 N002 N007 PMOS l=180n w=4400n
M16 N002 N027 0 0 NMOS l=180n w=2200n
M17 N061 N027 0 0 NMOS l=180n w=2200n
M18 N007 N014 N055 N007 PMOS l=180n w=4400n
M19 N055 N027 N061 N007 PMOS l=180n w=4400n
M20 N061 N014 0 0 NMOS l=180n w=2200n
M701 N365 N359 N374 N361 PMOS l=180n w=6000n
M702 N374 N378 N365 0 NMOS l=180n w=6000n
M703 N361 N365 N367 N361 PMOS l=180n w=3520n
M704 N367 N365 0 0 NMOS l=180n w=1760n
M705 N365 N367 N361 N361 PMOS l=180n w=880n
M706 0 N367 N365 0 NMOS l=180n w=440n
V70 N361 0 1.8V
C4 N365 0 1fF
C67 N367 0 1fF
M707 N385 N359 N392 N381 PMOS l=180n w=6000n
M708 N392 N378 N385 0 NMOS l=180n w=6000n
M709 N381 N385 N387 N381 PMOS l=180n w=3520n
M710 N387 N385 0 0 NMOS l=180n w=1760n
M711 N385 N387 N381 N381 PMOS l=180n w=880n
M712 0 N387 N385 0 NMOS l=180n w=440n
V71 N381 0 1.8V
C68 N385 0 1fF
C69 N387 0 1fF
M713 N364 N359 N373 N360 PMOS l=180n w=6000n
M714 N373 N378 N364 0 NMOS l=180n w=6000n
M715 N360 N364 N366 N360 PMOS l=180n w=3520n
M716 N366 N364 0 0 NMOS l=180n w=1760n
M717 N364 N366 N360 N360 PMOS l=180n w=880n
M718 0 N366 N364 0 NMOS l=180n w=440n
V72 N360 0 1.8V
C70 N364 0 1fF
C71 N366 0 1fF
M719 N384 N359 N393 N380 PMOS l=180n w=6000n
M720 N393 N378 N384 0 NMOS l=180n w=6000n
M721 N380 N384 N386 N380 PMOS l=180n w=3520n
M722 N386 N384 0 0 NMOS l=180n w=1760n
M723 N384 N386 N380 N380 PMOS l=180n w=880n
M724 0 N386 N384 0 NMOS l=180n w=440n
V73 N380 0 1.8V
C72 N384 0 1fF
C73 N386 0 1fF
V74 N370 0 1.8V
M725 N370 N359 N378 N370 PMOS l=180n w=8800n
M726 N378 N359 0 0 NMOS l=180n w=4400n
M727 N370 N301 N392 N370 PMOS l=180n w=4000n
M728 N392 N301 0 0 NMOS l=180n w=2000n
M729 N370 N218 N374 N370 PMOS l=180n w=4000n
M730 N374 N218 0 0 NMOS l=180n w=2000n
M731 N393 N344 0 0 NMOS l=180n w=2000n
M732 N370 N344 N393 N370 PMOS l=180n w=4000n
M733 N370 N257 N373 N370 PMOS l=180n w=4000n
M734 N373 N257 0 0 NMOS l=180n w=2000n
M735 N369 N359 N377 N363 PMOS l=180n w=6000n
M736 N377 N379 N369 0 NMOS l=180n w=6000n
M737 N363 N369 N372 N363 PMOS l=180n w=3520n
M738 N372 N369 0 0 NMOS l=180n w=1760n
M739 N369 N372 N363 N363 PMOS l=180n w=880n
M740 0 N372 N369 0 NMOS l=180n w=440n
V75 N363 0 1.8V
C74 N369 0 1fF
C75 N372 0 1fF
M741 N389 N359 N394 N383 PMOS l=180n w=6000n
M742 N394 N379 N389 0 NMOS l=180n w=6000n
M743 N383 N389 N391 N383 PMOS l=180n w=3520n
M744 N391 N389 0 0 NMOS l=180n w=1760n
M745 N389 N391 N383 N383 PMOS l=180n w=880n
M746 0 N391 N389 0 NMOS l=180n w=440n
V76 N383 0 1.8V
C76 N389 0 1fF
C77 N391 0 1fF
M747 N368 N359 N375 N362 PMOS l=180n w=6000n
M748 N375 N379 N368 0 NMOS l=180n w=6000n
M749 N362 N368 N371 N362 PMOS l=180n w=3520n
M750 N371 N368 0 0 NMOS l=180n w=1760n
M751 N368 N371 N362 N362 PMOS l=180n w=880n
M752 0 N371 N368 0 NMOS l=180n w=440n
V77 N362 0 1.8V
C78 N368 0 1fF
C79 N371 0 1fF
M753 N388 N359 N395 N382 PMOS l=180n w=6000n
M754 N395 N379 N388 0 NMOS l=180n w=6000n
M755 N382 N388 N390 N382 PMOS l=180n w=3520n
M756 N390 N388 0 0 NMOS l=180n w=1760n
M757 N388 N390 N382 N382 PMOS l=180n w=880n
M758 0 N390 N388 0 NMOS l=180n w=440n
V78 N382 0 1.8V
C80 N388 0 1fF
C81 N390 0 1fF
V79 N376 0 1.8V
M759 N376 N359 N379 N376 PMOS l=180n w=8800n
M760 N379 N359 0 0 NMOS l=180n w=4400n
M761 N376 N352 N394 N376 PMOS l=180n w=4000n
M762 N394 N352 0 0 NMOS l=180n w=2000n
M763 N376 N348 N377 N376 PMOS l=180n w=4000n
M764 N377 N348 0 0 NMOS l=180n w=2000n
M765 N395 N342 0 0 NMOS l=180n w=2000n
M766 N376 N342 N395 N376 PMOS l=180n w=4000n
M767 N376 N349 N375 N376 PMOS l=180n w=4000n
M768 N375 N349 0 0 NMOS l=180n w=2000n
M769 N370 N061 N359 N370 PMOS l=180n w=8800n
M770 N359 N061 0 0 NMOS l=180n w=4400n
.model NMOS NMOS
.model PMOS PMOS
.lib standard.mos
* LOT: n94s                  WAF: 08
* Temperature_parameters=Default
.MODEL nmos nmos LEVEL = 8
+VERSION = 3.1            TNOM    = 27             TOX     = 5.8E-9
+XJ      = 1E-7           NCH     = 2.3549E17      VTH0    = 0.4308936
+K1      = 0.3519429      K2      = 0.0298493      K3      = 1E-3
+K3B     = 0.0592323      W0      = 1E-5           NLX     = 1.465901E-7
+DVT0W   = 0              DVT1W   = 0              DVT2W   = 0
+DVT0    = 0.0183405      DVT1    = 4.897584E-3    DVT2    = -0.0252658
+U0      = 455.3033362    UA      = 5.223592E-10   UB      = 1.104713E-18
+UC      = 3.287888E-11   VSAT    = 1.050993E5     A0      = 1.2318623
+AGS     = 0.3043334      B0      = 6.67749E-8     B1      = 5E-6
+KETA    = 8.518046E-4    A1      = 0              A2      = 1
+RDSW    = 509.5675851    PRWG    = 0.0227558      PRWB    = -1E-3
+WR      = 1              WINT    = 2.126497E-9    LINT    = 4.393474E-9
+XL      = -3E-8          XW      = 0              DWG     = -3.409033E-9
+DWB     = 2.794842E-9    VOFF    = -0.1026054     NFACTOR = 0.1344887
+CIT     = 0              CDSC    = 1.527511E-3    CDSCD   = 0
+CDSCB   = 0              ETA0    = 3.48737E-3     ETAB    = 4.557986E-4
+DSUB    = 3.045473E-3    PCLM    = 1.0446257      PDIBLC1 = 0.1441952
+PDIBLC2 = 4.513382E-4    PDIBLCB = -2.816756E-5   DROUT   = 0.4698725
+PSCBE1  = 1.761109E10    PSCBE2  = 3.772916E-9    PVAG    = 0.0361824
+DELTA   = 0.01           MOBMOD  = 1              PRT     = 0
+UTE     = -1.5           KT1     = -0.11          KT1L    = 0
+KT2     = 0.022          UA1     = 4.31E-9        UB1     = -7.61E-18
+UC1     = -5.6E-11       AT      = 3.3E4          WL      = 0
+WLN     = 1              WW      = 0              WWN     = 1
+WWL     = 0              LL      = 0              LLN     = 1
+LW      = 0              LWN     = 1              LWL     = 0
+CAPMOD  = 2              XPART   = 0.4            CGDO    = 6.27E-10
+CGSO    = 6.27E-10       CGBO    = 0              CJ      = 1.918655E-3
+PB      = 0.9784049      MJ      = 0.4721729      CJSW    = 4.441595E-10
+PBSW    = 0.9419636      MJSW    = 0.2871118      PVTH0   = 1.342985E-3
+PRDSW   = -61.8357222    PK2     = -3.140724E-3   WKETA   = 7.512693E-4
+LKETA   = -6.144062E-3
* LOT: n94s                  WAF: 08
* Temperature_parameters=Default
.MODEL pmos pmos LEVEL = 8
+VERSION = 3.1            TNOM    = 27             TOX     = 5.8E-9
+XJ      = 1E-7           NCH     = 4.1589E17      VTH0    = -0.6158735
+K1      = 0.4598379      K2      = 0.0399415      K3      = 0
+K3B     = 8.7410723      W0      = 1E-6           NLX     = 1E-9
+DVT0W   = 0              DVT1W   = 0              DVT2W   = 0
+DVT0    = 0.6249485      DVT1    = 0.203296       DVT2    = -0.0513763
+U0      = 158.67524      UA      = 2.200024E-10   UB      = 4.457415E-18
+UC      = 1.02138E-10    VSAT    = 1.85064E5      A0      = 1.3826397
+AGS     = 0.4192977      B0      = 2.844099E-6    B1      = 5E-6
+KETA    = 0.0208695      A1      = 0              A2      = 1
+RDSW    = 968.5463       PRWG    = -0.1026483     PRWB    = -0.325
+WR      = 1              WINT    = 2.748811E-8    LINT    = 8.71907E-9
+XL      = -3E-8          XW      = 0              DWG     = -4.087585E-8
+DWB     = 2.032008E-8    VOFF    = -0.15          NFACTOR = 1.5460516
+CIT     = 0              CDSC    = 1.413317E-4    CDSCD   = 0
+CDSCB   = 0              ETA0    = 0.3241245      ETAB    = -0.1842
+DSUB    = 1.0287138      PCLM    = 5.2654567      PDIBLC1 = 4.228338E-3
+PDIBLC2 = 1.204519E-3    PDIBLCB = 2.37525E-3     DROUT   = 0
+PSCBE1  = 3.011456E10    PSCBE2  = 3.037042E-7    PVAG    = 8.9564294
+DELTA   = 0.01           MOBMOD  = 1              PRT     = 0
+UTE     = -1.5           KT1     = -0.11          KT1L    = 0
+KT2     = 0.022          UA1     = 4.31E-9        UB1     = -7.61E-18
+UC1     = -5.6E-11       AT      = 3.3E4          WL      = 0
+WLN     = 1              WW      = 0              WWN     = 1
+WWL     = 0              LL      = 0              LLN     = 1
+LW      = 0              LWN     = 1              LWL     = 0
+CAPMOD  = 2              XPART   = 0.4            CGDO    = 5.59E-10
+CGSO    = 5.59E-10       CGBO    = 0              CJ      = 1.882857E-3
+PB      = 0.9891317      MJ      = 0.4679789      CJSW    = 3.67186E-10
+PBSW    = 0.9884654      MJSW    = 0.3562128      PVTH0   = 3.923756E-3
+PRDSW   = 15.3953053     PK2     = 2.061759E-3    WKETA   = 4.10049E-3
+LKETA   = -0.0232426     LVSAT   = 1.257E5
.tran 6n
* I0
* I1
* I0
* I1
* Load
* I1
* I1
* -I0
* -I0
* I0
* I1
* -I0
* -I1
* Adder
* I0
* I0
* -I1
* -I1
* -I1
* -I1
* Subtract
* -I0
* -I0
* Multiply
* I1
* I1
* -I0
* -I0
* I0
* I1
* -I0
* -I1
* I0
* I0
* -I1
* -I1
* -I1
* -I1
* -I0
* -I0
* Address A
* Address B
* Address C
* Address decoder
* Command decoder
* I0
* I1
* I0
* I1
* Address
* Command
* CLK
* CLK_bar
* D_bar
* D
* D
* Q
* D
* CLK
* CLK_bar
* D_bar
* D
* D
* Q
* D
* CLK
* CLK_bar
* D_bar
* D
* D
* Q
* D
* CLK
* CLK_bar
* D_bar
* D
* D
* Q
* D
* CLK
* CLK_bar
* A Memory
* Load
* Address A
* A0
* w0
* w1
* w2
* w3
* A1
* A2
* A3
* -w0
* -w1
* -w2
* -w3
* A3
* A2
* A1
* A0
* CLK
* CLK_bar
* D_bar
* D
* D
* Q
* D
* CLK
* CLK_bar
* D_bar
* D
* D
* Q
* D
* CLK
* CLK_bar
* D_bar
* D
* D
* Q
* D
* CLK
* CLK_bar
* D_bar
* D
* D
* Q
* D
* CLK
* CLK_bar
* B Memory
* Load
* w0
* w1
* w2
* w3
* -w0
* -w1
* -w2
* -w3
* Address B
* B0
* B1
* B3
* B2
* B0
* B1
* B2
* B3
* CLK
* CLK_bar
* D_bar
* D
* D
* Q
* D
* CLK
* CLK_bar
* D_bar
* D
* D
* Q
* D
* CLK
* CLK_bar
* D_bar
* D
* D
* Q
* D
* CLK
* CLK_bar
* D_bar
* D
* D
* Q
* D
* CLK
* CLK_bar
* Load
* w0
* w1
* w2
* w3
* -w0
* -w1
* -w2
* -w3
* C Memory
* C0
* C1
* C2
* C3
* Address C
* C0
* C1
* C2
* C3
* -A
* -B
* -C
* A
* B
* C
* B
* -A
* A
* -B
* A
* A[xor]B
* -(A[xor]B)
* -(A[xor]B)
* A[xor]B
* A[xor]B
* C
* S0
* C
* -(A[xor]B)
* -(A[xor]B)
* A[xor]B
* B
* C_out
* XOR(AB)
* -A
* -B
* -C
* A
* B
* C
* B
* -A
* A
* -B
* A
* A[xor]B
* -(A[xor]B)
* -(A[xor]B)
* A[xor]B
* A[xor]B
* C
* S1
* C
* -(A[xor]B)
* -(A[xor]B)
* A[xor]B
* B
* C_out
* XOR(AB)
* -A
* -B
* -C
* A
* B
* C
* B
* -A
* A
* -B
* A
* A[xor]B
* -(A[xor]B)
* -(A[xor]B)
* A[xor]B
* A[xor]B
* C
* S2
* C
* -(A[xor]B)
* -(A[xor]B)
* A[xor]B
* B
* C_out
* XOR(AB)
* -A
* -B
* -C
* A
* B
* C
* B
* -A
* A
* -B
* A
* A[xor]B
* -(A[xor]B)
* -(A[xor]B)
* A[xor]B
* A[xor]B
* C
* S3
* C
* -(A[xor]B)
* -(A[xor]B)
* A[xor]B
* B
* C_out
* XOR(AB)
* -Ctrl
* -B
* Ctrl
* B0
* A0
* B
* -Ctrl
* Ctrl
* -B
* Ctrl
* -B
* B1
* A1
* B
* -Ctrl
* Ctrl
* -B
* Ctrl
* -B
* B2
* A2
* B
* -Ctrl
* Ctrl
* -B
* Ctrl
* -B
* A3
* B3
* B
* -Ctrl
* -B
* Ctrl
* Ctrl
* Adder
* Subtract
* Adder
* -Subtract
* Subtract
* Ctrl
* NOR(Add+Sub)
* NOR(Add+Sub)
* -A0
* NOR(Add+Sub)
* A0
* -A1
* A1
* A1
* A0
* NOR(Add+Sub)
* A2
* -A2
* A2
* NOR(Add+Sub)
* A3
* -A3
* A3
* NOR(Add+Sub)
* NOR(Add+Sub)
* NOR(Add+Sub)
* NOR(Add+Sub)
* B0
* B1
* B3
* B2
* -B0
* -B1
* -B2
* -B3
* B0
* B1
* B2
* B3
* CLK
* CLK_bar
* D_bar
* D
* D
* Q
* D
* CLK
* CLK_bar
* D_bar
* D
* D
* Q
* D
* CLK
* CLK_bar
* D_bar
* D
* D
* Q
* D
* CLK
* CLK_bar
* D_bar
* D
* D
* Q
* D
* CLK
* CLK_bar
* w0
* w1
* w2
* w3
* -w0
* -w1
* -w2
* -w3
* Adder/Subtractor
* X Memory
* NOR(Add+Subtract)
* X0
* X1
* X2
* X3
* X0
* X1
* X2
* X3
* -A
* -B
* A
* B
* C
* B
* -A
* A
* -B
* A
* P1
* XOR(AB)
* C_out
* -A
* -A
* -B
* -B
* P0
* A0
* B0
* A1
* A0
* B0
* A1
* B0
* A0
* B1
* B1
* -A
* -B
* -C
* A
* B
* C
* B
* -A
* A
* -B
* A
* A[xor]B
* -(A[xor]B)
* -(A[xor]B)
* A[xor]B
* A[xor]B
* C
* S0
* C
* -(A[xor]B)
* -(A[xor]B)
* A[xor]B
* B
* C_out
* XOR(AB)
* A2
* B0
* A1
* B1
* A2
* -A
* -B
* -C
* A
* B
* C
* B
* -A
* A
* -B
* A
* A[xor]B
* -(A[xor]B)
* -(A[xor]B)
* A[xor]B
* A[xor]B
* C
* S0
* C
* -(A[xor]B)
* -(A[xor]B)
* A[xor]B
* B
* C_out
* XOR(AB)
* A3
* B0
* A2
* B1
* A3
* -A
* -B
* A
* B
* C
* B
* -A
* A
* -B
* A
* S
* XOR(AB)
* C_out
* -A
* -A
* -B
* -B
* A3
* B1
* -A
* -B
* A
* B
* C
* B
* -A
* A
* -B
* A
* P2
* XOR(AB)
* C_out
* -A
* -A
* -B
* -B
* -A
* -B
* -C
* A
* B
* C
* B
* -A
* A
* -B
* A
* A[xor]B
* -(A[xor]B)
* -(A[xor]B)
* A[xor]B
* A[xor]B
* C
* S0
* C
* -(A[xor]B)
* -(A[xor]B)
* A[xor]B
* B
* C_out
* XOR(AB)
* -A
* -B
* -C
* A
* B
* C
* B
* -A
* A
* -B
* A
* A[xor]B
* -(A[xor]B)
* -(A[xor]B)
* A[xor]B
* A[xor]B
* C
* S0
* C
* -(A[xor]B)
* -(A[xor]B)
* A[xor]B
* B
* C_out
* XOR(AB)
* -A
* -B
* -C
* A
* B
* C
* B
* -A
* A
* -B
* A
* A[xor]B
* -(A[xor]B)
* -(A[xor]B)
* A[xor]B
* A[xor]B
* C
* S0
* C
* -(A[xor]B)
* -(A[xor]B)
* A[xor]B
* B
* C_out
* XOR(AB)
* A0
* B2
* A1
* B2
* A2
* B2
* A3
* B2
* B2
* S0
* S0
* S
* -A
* -B
* A
* B
* C
* B
* -A
* A
* -B
* A
* P3
* XOR(AB)
* C_out
* -A
* -A
* -B
* -B
* -A
* -B
* -C
* A
* B
* C
* B
* -A
* A
* -B
* A
* A[xor]B
* -(A[xor]B)
* -(A[xor]B)
* A[xor]B
* A[xor]B
* C
* P4
* C
* -(A[xor]B)
* -(A[xor]B)
* A[xor]B
* B
* C_out
* XOR(AB)
* -A
* -B
* -C
* A
* B
* C
* B
* -A
* A
* -B
* A
* A[xor]B
* -(A[xor]B)
* -(A[xor]B)
* A[xor]B
* A[xor]B
* C
* P5
* C
* -(A[xor]B)
* -(A[xor]B)
* A[xor]B
* B
* C_out
* XOR(AB)
* -A
* -B
* -C
* A
* B
* C
* B
* -A
* A
* -B
* A
* A[xor]B
* -(A[xor]B)
* -(A[xor]B)
* A[xor]B
* A[xor]B
* C
* P6
* C
* -(A[xor]B)
* -(A[xor]B)
* A[xor]B
* B
* P7
* XOR(AB)
* A0
* B3
* A1
* A2
* A3
* S0
* S0
* S
* B3
* B3
* B3
* B3
* Multiplier
* Multiplier
* Multiplier
* Multiplier
* Multiplier
* Multiplier
* Multiplier
* Multiplier
* Multiplier
* C0
* C1
* X0
* X1
* X2
* X3
* C2
* C3
* X0
* X2
* X3
* X1
* C0
* C2
* C1
* C3
* CLK
* CLK_bar
* D_bar
* D
* D
* Q
* D
* CLK
* CLK_bar
* D_bar
* D
* D
* Q
* D
* CLK
* CLK_bar
* D_bar
* D
* D
* Q
* D
* CLK
* CLK_bar
* D_bar
* D
* D
* Q
* D
* CLK
* CLK_bar
* w1
* w2
* w3
* -w0
* -w1
* -w2
* -w3
* CLK
* CLK_bar
* D_bar
* D
* D
* Q
* D
* CLK
* CLK_bar
* D_bar
* D
* D
* Q
* D
* CLK
* CLK_bar
* D_bar
* D
* D
* Q
* D
* CLK
* CLK_bar
* D_bar
* D
* D
* Q
* D
* CLK
* CLK_bar
* w1
* w2
* w3
* -w0
* -w1
* -w2
* -w3
* Y Memory
* Y0
* Y1
* Y2
* Y3
* Y4
* Y5
* Y6
* Y7
* Multiplier
* w0
* w0
.backanno
.end